# Altium project IM_v1.0.PrjPcb (part 1 of 2)
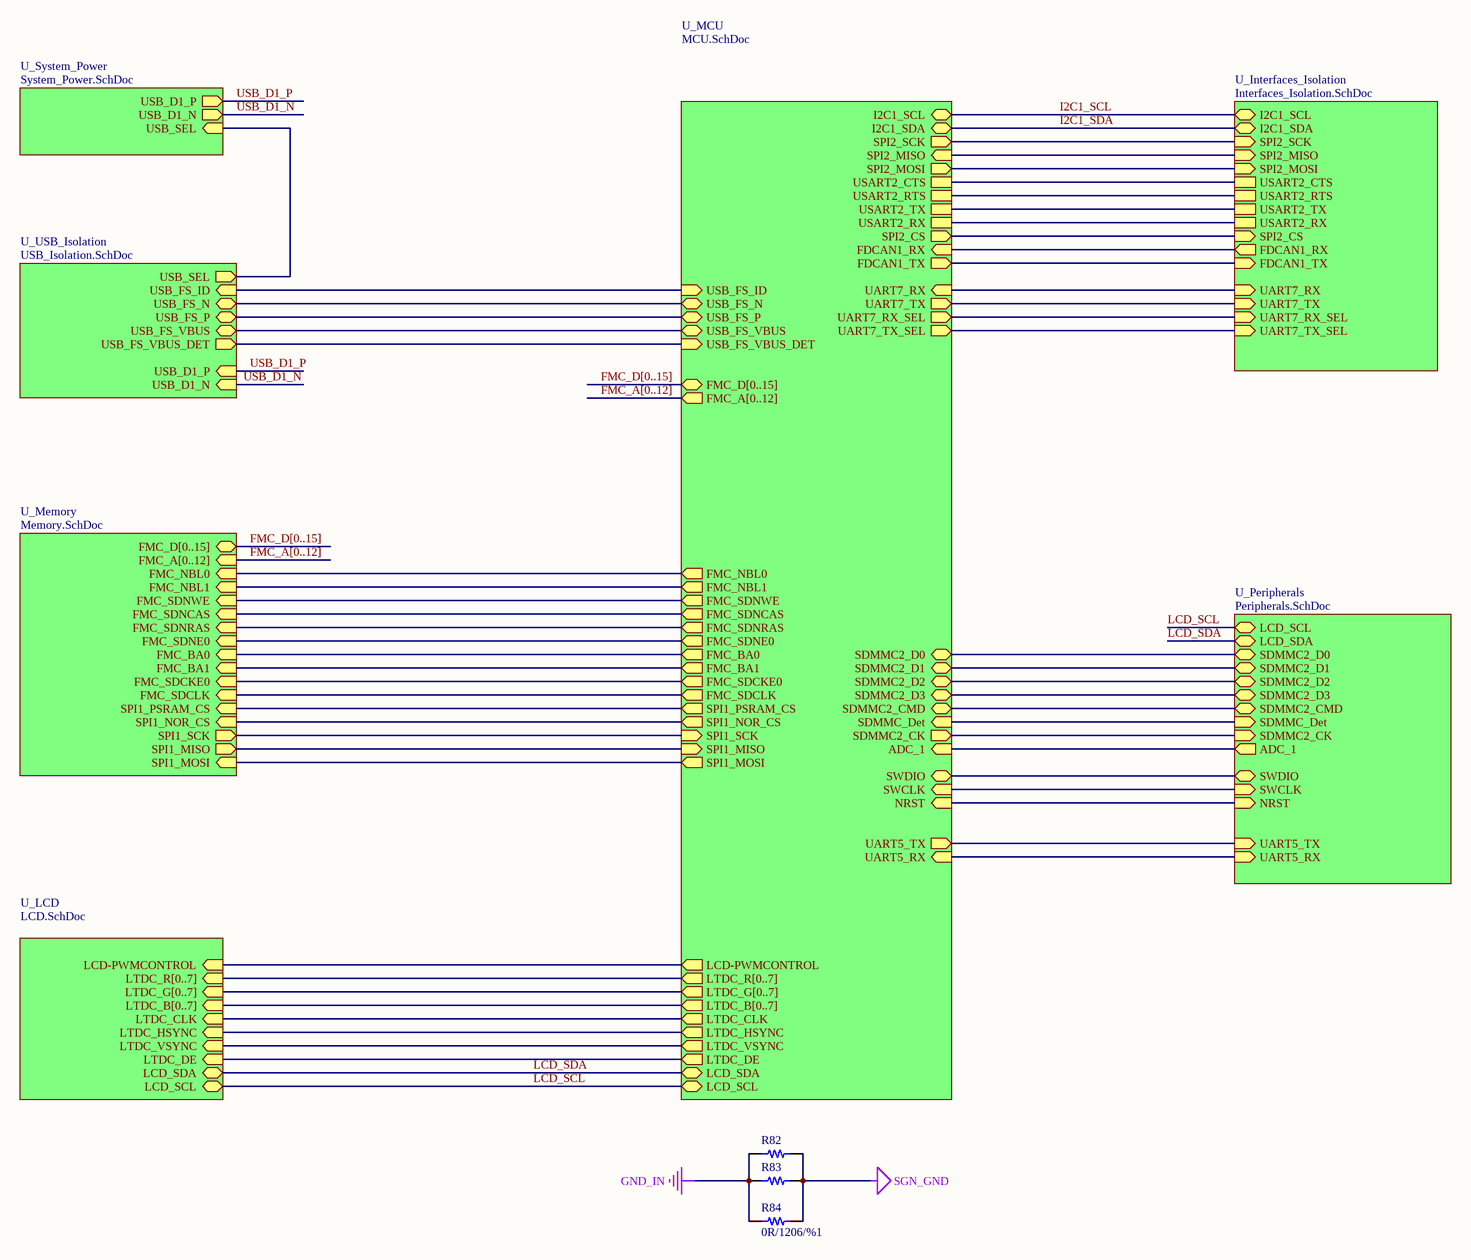
[diagram p0: Main.SchDoc]
8 sheets, 293 parts. Net scope: hierarchical (ports join the sheet entries above them; power ports are global).
Board files: IM_v1.0.PcbDoc, IM_v1.1.PcbDoc
Sheets:
  Main.SchDoc
    U_Interfaces_Isolation = Interfaces_Isolation.SchDoc
    U_LCD = LCD.SchDoc
    U_Memory = Memory.SchDoc
    U_Peripherals = Peripherals.SchDoc
    U_System_Power = System_Power.SchDoc
    U_USB_Isolation = USB_Isolation.SchDoc
    U_MCU = MCU.SchDoc

## Sheet Main.SchDoc
size A3; SheetNumber: 1; SheetTotal: 8

### Parts
R82  0R/1206/%1  [1206_res]  (value not drawn)
R83  0R/1206/%1  [1206_res]  (value not drawn)
R84  0R/1206/%1  [1206_res]

### Sub-sheets
U_Interfaces_Isolation = Interfaces_Isolation.SchDoc: I2C1_SCL (bidir), I2C1_SDA (bidir), SPI2_SCK (in), SPI2_MISO (in), SPI2_MOSI (in), USART2_CTS, USART2_RTS, USART2_TX, USART2_RX, FDCAN1_RX (out), FDCAN1_TX (in), SPI2_CS (in), UART7_RX (in), UART7_TX (in), UART7_RX_SEL (in), UART7_TX_SEL (in)
U_LCD = LCD.SchDoc: LTDC_R[0..7] (in), LTDC_G[0..7] (in), LTDC_B[0..7] (in), LTDC_CLK (in), LTDC_HSYNC (in), LTDC_VSYNC (in), LTDC_DE (in), LCD_SDA (bidir), LCD_SCL (bidir), LCD-PWMCONTROL (in)
U_MCU = MCU.SchDoc: LTDC_R[0..7] (out), LTDC_G[0..7] (out), LTDC_B[0..7] (out), FMC_D[0..15] (bidir), FMC_A[0..12] (out), FMC_NBL1 (out), FMC_SDNWE (out), FMC_SDNCAS (out), FMC_SDNRAS (out), FMC_SDNE0 (out), FMC_BA0 (out), FMC_BA1 (out), FMC_SDCKE0 (out), FMC_SDCLK (out), FMC_NBL0 (out), USART2_CTS, USART2_RTS, USART2_TX, USART2_RX, SPI1_MISO (in), SPI1_MOSI (out), SPI1_SCK (in), I2C1_SCL (bidir), I2C1_SDA (bidir), LCD_SDA (bidir), LCD_SCL (bidir), FDCAN1_RX (in), FDCAN1_TX (out), SPI2_MOSI (out), SPI2_SCK (out), SPI2_MISO (in), LCD-PWMCONTROL (out), LTDC_VSYNC (out), LTDC_HSYNC (out), LTDC_DE (out), LTDC_CLK (out), SPI1_NOR_CS (out), SPI2_CS (out), SPI1_PSRAM_CS (out), SDMMC2_D0 (bidir), SDMMC2_D1 (bidir), SDMMC2_D2 (bidir), SDMMC2_D3 (bidir), SDMMC2_CMD (bidir), SDMMC2_CK (out), SWDIO (bidir), SWCLK (in), NRST (in), UART5_RX (in), UART5_TX (out), SDMMC_Det (in), UART7_RX (in), UART7_TX (out), UART7_RX_SEL (out), UART7_TX_SEL (out), ADC_1 (in), USB_FS_ID (in), USB_FS_VBUS (bidir), USB_FS_N (bidir), USB_FS_P (bidir), USB_FS_VBUS_DET (in)
U_Memory = Memory.SchDoc: FMC_D[0..15] (bidir), FMC_A[0..12] (in), FMC_NBL1 (in), FMC_SDNWE (in), FMC_SDNCAS (in), FMC_SDNRAS (in), FMC_SDNE0 (in), FMC_BA0 (in), FMC_BA1 (in), FMC_SDCKE0 (in), FMC_SDCLK (in), FMC_NBL0 (in), SPI1_MISO (out), SPI1_MOSI (in), SPI1_SCK (out), SPI1_PSRAM_CS (in), SPI1_NOR_CS (in)
U_Peripherals = Peripherals.SchDoc: LCD_SCL (bidir), LCD_SDA (bidir), SDMMC2_D0 (bidir), SDMMC2_D1 (bidir), SDMMC2_D2 (bidir), SDMMC2_D3 (bidir), SDMMC2_CMD (bidir), SDMMC2_CK (in), SDMMC_Det (in), SWDIO (bidir), SWCLK (in), UART5_RX (in), UART5_TX (in), NRST (in), ADC_1 (out)
U_System_Power = System_Power.SchDoc: USB_D1_P (out), USB_D1_N (out), USB_SEL (in)
U_USB_Isolation = USB_Isolation.SchDoc: USB_D1_P (in), USB_D1_N (in), USB_SEL (out), USB_FS_ID (in), USB_FS_N (bidir), USB_FS_P (bidir), USB_FS_VBUS (bidir), USB_FS_VBUS_DET (out)

### Nets
GND_IN: R82.2 R83.2 R84.2
SGN_GND: R82.1 R83.1 R84.1
ADC_1: sheet U_Peripherals/ADC_1, sheet U_MCU/ADC_1
FDCAN1_RX: sheet U_Interfaces_Isolation/FDCAN1_RX, sheet U_MCU/FDCAN1_RX
FDCAN1_TX: sheet U_Interfaces_Isolation/FDCAN1_TX, sheet U_MCU/FDCAN1_TX
FMC_BA0: sheet U_Memory/FMC_BA0, sheet U_MCU/FMC_BA0
FMC_BA1: sheet U_Memory/FMC_BA1, sheet U_MCU/FMC_BA1
FMC_NBL0: sheet U_Memory/FMC_NBL0, sheet U_MCU/FMC_NBL0
FMC_NBL1: sheet U_Memory/FMC_NBL1, sheet U_MCU/FMC_NBL1
FMC_SDCKE0: sheet U_Memory/FMC_SDCKE0, sheet U_MCU/FMC_SDCKE0
FMC_SDCLK: sheet U_Memory/FMC_SDCLK, sheet U_MCU/FMC_SDCLK
FMC_SDNCAS: sheet U_Memory/FMC_SDNCAS, sheet U_MCU/FMC_SDNCAS
FMC_SDNE0: sheet U_Memory/FMC_SDNE0, sheet U_MCU/FMC_SDNE0
FMC_SDNRAS: sheet U_Memory/FMC_SDNRAS, sheet U_MCU/FMC_SDNRAS
FMC_SDNWE: sheet U_Memory/FMC_SDNWE, sheet U_MCU/FMC_SDNWE
I2C1_SCL: sheet U_Interfaces_Isolation/I2C1_SCL, sheet U_MCU/I2C1_SCL
I2C1_SDA: sheet U_Interfaces_Isolation/I2C1_SDA, sheet U_MCU/I2C1_SDA
LCD-PWMCONTROL: sheet U_LCD/LCD-PWMCONTROL, sheet U_MCU/LCD-PWMCONTROL
LCD_SCL: sheet U_LCD/LCD_SCL, sheet U_Peripherals/LCD_SCL, sheet U_MCU/LCD_SCL
LCD_SDA: sheet U_LCD/LCD_SDA, sheet U_Peripherals/LCD_SDA, sheet U_MCU/LCD_SDA
LTDC_CLK: sheet U_LCD/LTDC_CLK, sheet U_MCU/LTDC_CLK
LTDC_DE: sheet U_LCD/LTDC_DE, sheet U_MCU/LTDC_DE
LTDC_HSYNC: sheet U_LCD/LTDC_HSYNC, sheet U_MCU/LTDC_HSYNC
LTDC_VSYNC: sheet U_LCD/LTDC_VSYNC, sheet U_MCU/LTDC_VSYNC
NRST: sheet U_Peripherals/NRST, sheet U_MCU/NRST
SDMMC2_CK: sheet U_Peripherals/SDMMC2_CK, sheet U_MCU/SDMMC2_CK
SDMMC2_CMD: sheet U_Peripherals/SDMMC2_CMD, sheet U_MCU/SDMMC2_CMD
SDMMC2_D0: sheet U_Peripherals/SDMMC2_D0, sheet U_MCU/SDMMC2_D0
SDMMC2_D1: sheet U_Peripherals/SDMMC2_D1, sheet U_MCU/SDMMC2_D1
SDMMC2_D2: sheet U_Peripherals/SDMMC2_D2, sheet U_MCU/SDMMC2_D2
SDMMC2_D3: sheet U_Peripherals/SDMMC2_D3, sheet U_MCU/SDMMC2_D3
SDMMC_Det: sheet U_Peripherals/SDMMC_Det, sheet U_MCU/SDMMC_Det
SPI1_MISO: sheet U_Memory/SPI1_MISO, sheet U_MCU/SPI1_MISO
SPI1_MOSI: sheet U_Memory/SPI1_MOSI, sheet U_MCU/SPI1_MOSI
SPI1_NOR_CS: sheet U_Memory/SPI1_NOR_CS, sheet U_MCU/SPI1_NOR_CS
SPI1_PSRAM_CS: sheet U_Memory/SPI1_PSRAM_CS, sheet U_MCU/SPI1_PSRAM_CS
SPI1_SCK: sheet U_Memory/SPI1_SCK, sheet U_MCU/SPI1_SCK
SPI2_CS: sheet U_Interfaces_Isolation/SPI2_CS, sheet U_MCU/SPI2_CS
SPI2_MISO: sheet U_Interfaces_Isolation/SPI2_MISO, sheet U_MCU/SPI2_MISO
SPI2_MOSI: sheet U_Interfaces_Isolation/SPI2_MOSI, sheet U_MCU/SPI2_MOSI
SPI2_SCK: sheet U_Interfaces_Isolation/SPI2_SCK, sheet U_MCU/SPI2_SCK
SWCLK: sheet U_Peripherals/SWCLK, sheet U_MCU/SWCLK
SWDIO: sheet U_Peripherals/SWDIO, sheet U_MCU/SWDIO
UART5_RX: sheet U_Peripherals/UART5_RX, sheet U_MCU/UART5_RX
UART5_TX: sheet U_Peripherals/UART5_TX, sheet U_MCU/UART5_TX
UART7_RX: sheet U_Interfaces_Isolation/UART7_RX, sheet U_MCU/UART7_RX
UART7_RX_SEL: sheet U_Interfaces_Isolation/UART7_RX_SEL, sheet U_MCU/UART7_RX_SEL
UART7_TX: sheet U_Interfaces_Isolation/UART7_TX, sheet U_MCU/UART7_TX
UART7_TX_SEL: sheet U_Interfaces_Isolation/UART7_TX_SEL, sheet U_MCU/UART7_TX_SEL
USART2_CTS: sheet U_Interfaces_Isolation/USART2_CTS, sheet U_MCU/USART2_CTS
USART2_RTS: sheet U_Interfaces_Isolation/USART2_RTS, sheet U_MCU/USART2_RTS
USART2_RX: sheet U_Interfaces_Isolation/USART2_RX, sheet U_MCU/USART2_RX
USART2_TX: sheet U_Interfaces_Isolation/USART2_TX, sheet U_MCU/USART2_TX
USB_D1_N: sheet U_System_Power/USB_D1_N, sheet U_USB_Isolation/USB_D1_N
USB_D1_P: sheet U_System_Power/USB_D1_P, sheet U_USB_Isolation/USB_D1_P
USB_FS_ID: sheet U_USB_Isolation/USB_FS_ID, sheet U_MCU/USB_FS_ID
USB_FS_N: sheet U_USB_Isolation/USB_FS_N, sheet U_MCU/USB_FS_N
USB_FS_P: sheet U_USB_Isolation/USB_FS_P, sheet U_MCU/USB_FS_P
USB_FS_VBUS: sheet U_USB_Isolation/USB_FS_VBUS, sheet U_MCU/USB_FS_VBUS
USB_FS_VBUS_DET: sheet U_USB_Isolation/USB_FS_VBUS_DET, sheet U_MCU/USB_FS_VBUS_DET
USB_SEL: sheet U_System_Power/USB_SEL, sheet U_USB_Isolation/USB_SEL

### Buses and harness runs
bus FMC_A[0..12] = sheet U_MCU/FMC_A[0..12]
bus FMC_A[0..12] = sheet U_Memory/FMC_A[0..12]
bus FMC_D[0..15] = sheet U_MCU/FMC_D[0..15]
bus FMC_D[0..15] = sheet U_Memory/FMC_D[0..15]
bus sheet U_LCD/LTDC_B[0..7] = sheet U_MCU/LTDC_B[0..7]
bus sheet U_LCD/LTDC_G[0..7] = sheet U_MCU/LTDC_G[0..7]
bus sheet U_LCD/LTDC_R[0..7] = sheet U_MCU/LTDC_R[0..7]

### Library data of the parts
R82-R84 = RES: Assembly: .; HelpURL: *; PN: *; Value: 0R/1206/%1

## Sheet Interfaces_Isolation.SchDoc
size 508 x 292 mm; SheetNumber: 3; SheetTotal: 8
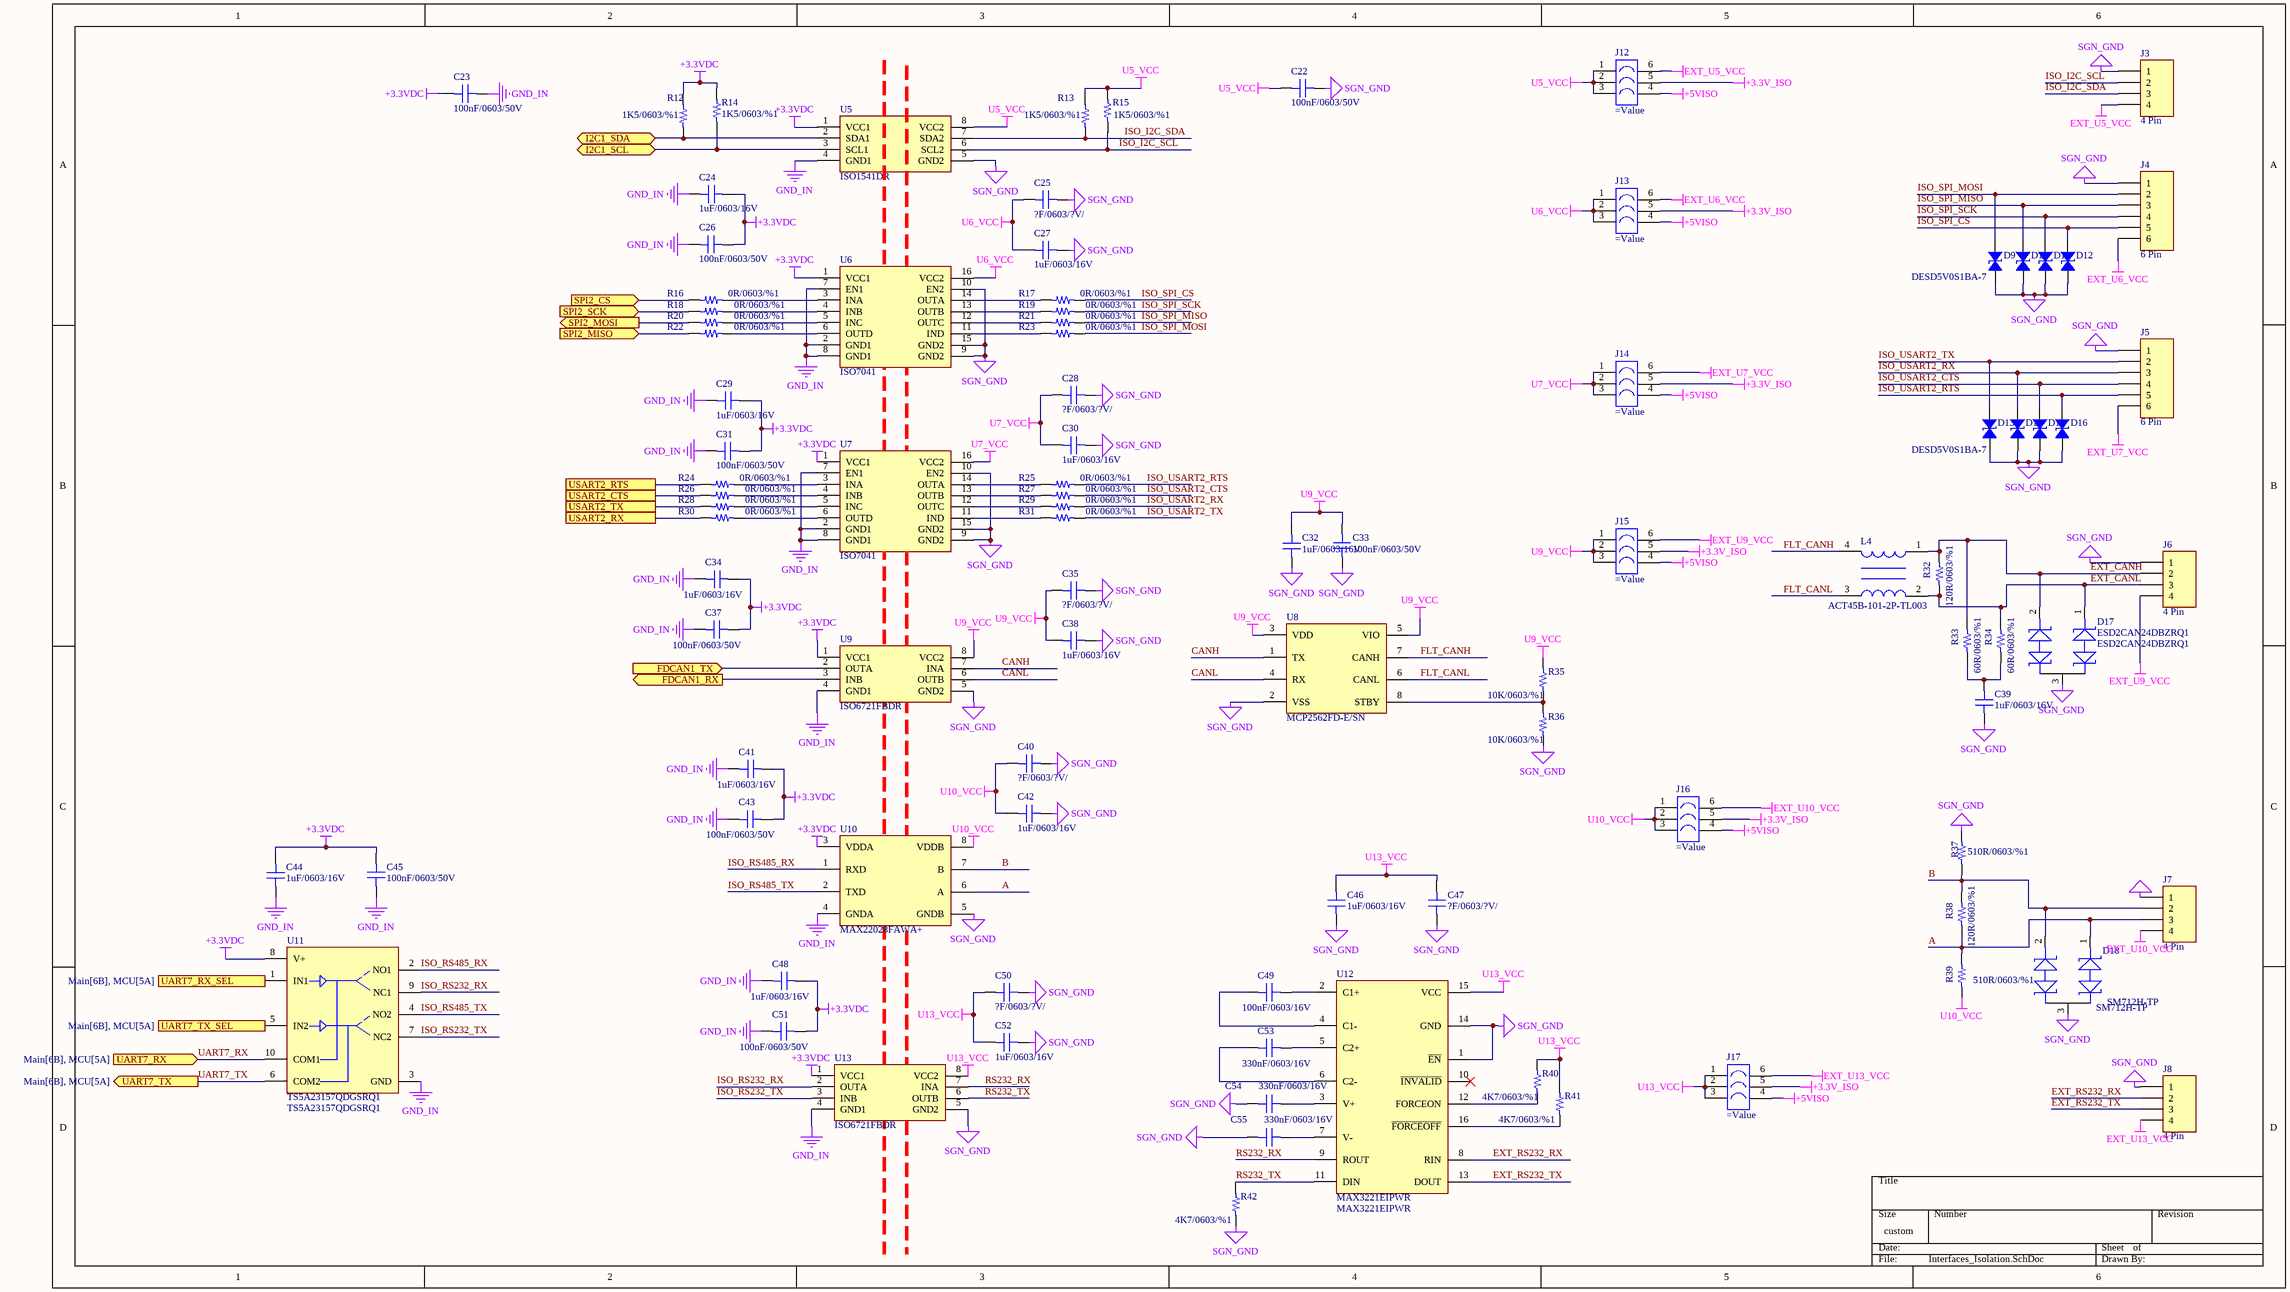
[diagram p1: Interfaces_Isolation.SchDoc]

### Parts
C22  100nF/0603/50V  [0603_cap]
C23  100nF/0603/50V  [0603_cap]
C24  1uF/0603/16V  [0603_cap]
C25  ?F/0603/?V/  [0603_cap]
C26  100nF/0603/50V  [0603_cap]
C27  1uF/0603/16V  [0603_cap]
C28  ?F/0603/?V/  [0603_cap]
C29  1uF/0603/16V  [0603_cap]
C30  1uF/0603/16V  [0603_cap]
C31  100nF/0603/50V  [0603_cap]
C32  1uF/0603/16V  [0603_cap]
C33  100nF/0603/50V  [0603_cap]
C34  1uF/0603/16V  [0603_cap]
C35  ?F/0603/?V/  [0603_cap]
C37  100nF/0603/50V  [0603_cap]
C38  1uF/0603/16V  [0603_cap]
C39  1uF/0603/16V  [0603_cap]
C40  ?F/0603/?V/  [0603_cap]
C41  1uF/0603/16V  [0603_cap]
C42  1uF/0603/16V  [0603_cap]
C43  100nF/0603/50V  [0603_cap]
C44  1uF/0603/16V  [0603_cap]
C45  100nF/0603/50V  [0603_cap]
C46  1uF/0603/16V  [0603_cap]
C47  ?F/0603/?V/  [0603_cap]
C48  1uF/0603/16V  [0603_cap]
C49  100nF/0603/16V  [0603_cap]
C50  ?F/0603/?V/  [0603_cap]
C51  100nF/0603/50V  [0603_cap]
C52  1uF/0603/16V  [0603_cap]
C53  330nF/0603/16V  [0603_cap]
C54  330nF/0603/16V  [0603_cap]
C55  330nF/0603/16V  [0603_cap]
D9  DESD5V0S1BA-7  [SOD323]
D10  DESD5V0S1BA-7  [SOD323]  (value not drawn)
D11  DESD5V0S1BA-7  [SOD323]  (value not drawn)
D12  DESD5V0S1BA-7  [SOD323]  (value not drawn)
D13  DESD5V0S1BA-7  [SOD323]
D14  DESD5V0S1BA-7  [SOD323]  (value not drawn)
D15  DESD5V0S1BA-7  [SOD323]  (value not drawn)
D16  DESD5V0S1BA-7  [SOD323]  (value not drawn)
D17  ESD2CAN24DBZRQ1  [TI SOT-23-3 DBZ]
D18  SM712H-TP  [TI SOT-23-3 DBZ]
J3  4 Pin  [R/A HEADER (4PİN)]
J4  6 Pin  [R/A HEADER]
J5  6 Pin  [R/A HEADER]
J6  4 Pin  [R/A HEADER (4PİN)]
J7  4 Pin  [R/A HEADER (4PİN)]
J8  4 Pin  [R/A HEADER (4PİN)]
J12  (no value)  [th_ra_6pins_1.27mm]
J13  (no value)  [th_ra_6pins_1.27mm]
J14  (no value)  [th_ra_6pins_1.27mm]
J15  (no value)  [th_ra_6pins_1.27mm]
J16  (no value)  [th_ra_6pins_1.27mm]
J17  (no value)  [th_ra_6pins_1.27mm]
L4  ACT45B-101-2P-TL003  [CMC((4.50mm x 3.20mm))]
R12  1K5/0603/%1  [0603_res]
R13  1K5/0603/%1  [0603_res]
R14  1K5/0603/%1  [0603_res]
R15  1K5/0603/%1  [0603_res]
R16  0R/0603/%1  [0603_res]
R17  0R/0603/%1  [0603_res]
R18  0R/0603/%1  [0603_res]
R19  0R/0603/%1  [0603_res]
R20  0R/0603/%1  [0603_res]
R21  0R/0603/%1  [0603_res]
R22  0R/0603/%1  [0603_res]
R23  0R/0603/%1  [0603_res]
R24  0R/0603/%1  [0603_res]
R25  0R/0603/%1  [0603_res]
R26  0R/0603/%1  [0603_res]
R27  0R/0603/%1  [0603_res]
R28  0R/0603/%1  [0603_res]
R29  0R/0603/%1  [0603_res]
R30  0R/0603/%1  [0603_res]
R31  0R/0603/%1  [0603_res]
R32  120R/0603/%1  [0603_res]
R33  60R/0603/%1  [0603_res]
R34  60R/0603/%1  [0603_res]
R35  10K/0603/%1  [0603_res]
R36  10K/0603/%1  [0603_res]
R37  510R/0603/%1  [0603_res]
R38  120R/0603/%1  [0603_res]
R39  510R/0603/%1  [0603_res]
R40  4K7/0603/%1  [0603_res]
R41  4K7/0603/%1  [0603_res]
R42  4K7/0603/%1  [0603_res]
U5  ISO1541DR  [SOIC-8(3.90MM)]
U6  ISO7041  [16-SSOP (0.154", 3.90mm Width)]
U7  ISO7041  [16-SSOP (0.154", 3.90mm Width)]
U8  MCP2562FD-E/SN  [SOIC-8(3.90MM)]
U9  ISO6721FBDR  [SOIC-8(3.90MM)]
U10  MAX22028FAWA+  [8-SOIC (0.209", 5.30mm Width)]
U11  TS5A23157QDGSRQ1  [VSSOP-10]
U12  MAX3221EIPWR  [16-TSSOP]
U13  ISO6721FBDR  [SOIC-8(3.90MM)]

### Ports
FDCAN1_RX (out, see Main[6B], MCU[3A]), FDCAN1_TX (in, see Main[6B], MCU[3A]), I2C1_SCL (bidir, see Main[6A], MCU[6A]), I2C1_SDA (bidir, see Main[6A], MCU[6A]), SPI2_CS (in, see Main[6B], MCU[6A]), SPI2_MISO (in, see Main[6A], MCU[6A]), SPI2_MOSI (out, see Main[6A], MCU[6A]), SPI2_SCK (in, see Main[6A], MCU[6A]), UART7_RX (in, see Main[6B], MCU[5A]), UART7_RX_SEL (in, see Main[6B], MCU[5A]), UART7_TX (out, see Main[6B], MCU[5A]), UART7_TX_SEL (in, see Main[6B], MCU[5A]), USART2_CTS (see Main[6A], MCU[4A]), USART2_RTS (see Main[6B], MCU[4A]), USART2_RX (see Main[6B], MCU[4A]), USART2_TX (see Main[6B], MCU[4A])

### Nets
+3.3V_ISO: J12.5 J13.5 J14.5 J15.5 J16.5 J17.5
+3.3VDC: C23.2 C24.2 C26.1 C29.2 C31.1 C34.2 C37.1 C41.2 C43.1 C44.2 C45.1 C48.2 C51.1 R12.2 R14.1 U5.1(VCC1) U6.1(VCC1) U7.1(VCC1) U9.1(VCC1) U10.3(VDDA) U11.8(V+) U13.1(VCC1)
+5VISO: J12.4 J13.4 J14.4 J15.4 J16.4 J17.4
EXT_U5_VCC: J3.4 J12.6
EXT_U6_VCC: J4.6 J13.6
EXT_U7_VCC: J5.6 J14.6
EXT_U9_VCC: J6.4 J15.6
EXT_U10_VCC: J7.4 J16.6
EXT_U13_VCC: J8.4 J17.6
GND_IN: C23.1 C24.1 C26.2 C29.1 C31.2 C34.1 C37.2 C41.1 C43.2 C44.1 C45.2 C48.1 C51.2 U5.4(GND1) U6.2(GND1) U6.7(EN1) U6.8(GND1) U7.2(GND1) U7.7(EN1) U7.8(GND1) U9.4(GND1) U10.4(GNDA) U11.3(GND) U13.4(GND1)
SGN_GND: C22.1 C25.1 C27.1 C28.1 C30.1 C32.1 C33.2 C35.1 C38.1 C39.1 C40.1 C42.1 C46.1 C47.1 C50.1 C52.1 C54.2 C55.2 D9.1 D10.1 D11.1 D12.1 D13.1 D14.1 D15.1 D16.1 D17.3 D18.3 J3.1 J4.1 J5.1 J6.1 J7.1 J8.1 R36.2 R37.1 R42.2 U5.5(GND2) U6.9(GND2) U6.10(EN2) U6.15(GND2) U7.9(GND2) U7.10(EN2) U7.15(GND2) U8.2(VSS) U9.5(GND2) U10.5(GNDB) U12.1(~{EN}) U12.14(GND) U13.5(GND2)
U5_VCC: C22.2 J12.1 J12.2 J12.3 R13.2 R15.1 U5.8(VCC2)
U6_VCC: C25.2 C27.2 J13.1 J13.2 J13.3 U6.16(VCC2)
U7_VCC: C28.2 C30.2 J14.1 J14.2 J14.3 U7.16(VCC2)
U9_VCC: C32.2 C33.1 C35.2 C38.2 J15.1 J15.2 J15.3 R35.1 U8.3(VDD) U8.5(VIO) U9.8(VCC2)
U10_VCC: C40.2 C42.2 J16.1 J16.2 J16.3 R39.2 U10.8(VDDB)
U13_VCC: C46.2 C47.2 C50.2 C52.2 J17.1 J17.2 J17.3 R40.1 R41.1 U12.15(VCC) U13.8(VCC2)
A: D18.1 J7.3 R38.2 R39.1 U10.6(A)
B: D18.2 J7.2 R37.2 R38.1 U10.7(B)
CANH: U8.1(TX) U9.7(INA)
CANL: U8.4(RX) U9.6(OUTB)
EXT_CANH: D17.2 J6.2 L4.1 R32.1 R33.1
EXT_CANL: D17.1 J6.3 L4.2 R32.2 R34.1
EXT_RS232_RX: J8.2 U12.8(RIN)
EXT_RS232_TX: J8.3 U12.13(DOUT)
FDCAN1_RX: U9.3(INB) ; port FDCAN1_RX
FDCAN1_TX: U9.2(OUTA) ; port FDCAN1_TX
FLT_CANH: L4.4 U8.7(CANH)
FLT_CANL: L4.3 U8.6(CANL)
I2C1_SCL: R14.2 U5.3(SCL1) ; port I2C1_SCL
I2C1_SDA: R12.1 U5.2(SDA1) ; port I2C1_SDA
ISO_I2C_SCL: J3.2 R15.2 U5.6(SCL2)
ISO_I2C_SDA: J3.3 R13.1 U5.7(SDA2)
ISO_RS232_RX: U11.9(NC1) U13.2(OUTA)
ISO_RS232_TX: U11.7(NC2) U13.3(INB)
ISO_RS485_RX: U10.1(RXD) U11.2(NO1)
ISO_RS485_TX: U10.2(TXD) U11.4(NO2)
ISO_SPI_CS: D12.2 J4.5 R17.1
ISO_SPI_MISO: D10.2 J4.3 R21.1
ISO_SPI_MOSI: D9.2 J4.2 R23.1
ISO_SPI_SCK: D11.2 J4.4 R19.1
ISO_USART2_CTS: D15.2 J5.4 R27.1
ISO_USART2_RTS: D16.2 J5.5 R25.1
ISO_USART2_RX: D14.2 J5.3 R29.1
ISO_USART2_TX: D13.2 J5.2 R31.1
RS232_RX: U12.9(ROUT) U13.7(INA)
RS232_TX: R42.1 U12.11(DIN) U13.6(OUTB)
SPI2_CS: R16.2 ; port SPI2_CS
SPI2_MISO: R22.2 ; port SPI2_MISO
SPI2_MOSI: R20.2 ; port SPI2_MOSI
SPI2_SCK: R18.2 ; port SPI2_SCK
UART7_RX: U11.10(COM1) ; port UART7_RX
UART7_RX_SEL: U11.1(IN1) ; port UART7_RX_SEL
UART7_TX: U11.6(COM2) ; port UART7_TX
UART7_TX_SEL: U11.5(IN2) ; port UART7_TX_SEL
USART2_CTS: R26.2 ; port USART2_CTS
USART2_RTS: R24.2 ; port USART2_RTS
USART2_RX: R30.2 ; port USART2_RX
USART2_TX: R28.2 ; port USART2_TX
NetC39_2: C39.2 R33.2 R34.2
NetC49_1: C49.1 U12.2(C1+)
NetC49_2: C49.2 U12.4(C1-)
NetC53_1: C53.1 U12.5(C2+)
NetC53_2: C53.2 U12.6(C2-)
NetC54_1: C54.1 U12.3(V+)
NetC55_1: C55.1 U12.7(V-)
NetR16_1: R16.1 U6.3(INA)
NetR17_2: R17.2 U6.14(OUTA)
NetR18_1: R18.1 U6.4(INB)
NetR19_2: R19.2 U6.13(OUTB)
NetR20_1: R20.1 U6.5(INC)
NetR21_2: R21.2 U6.12(OUTC)
NetR22_1: R22.1 U6.6(OUTD)
NetR23_2: R23.2 U6.11(IND)
NetR24_1: R24.1 U7.3(INA)
NetR25_2: R25.2 U7.14(OUTA)
NetR26_1: R26.1 U7.4(INB)
NetR27_2: R27.2 U7.13(OUTB)
NetR28_1: R28.1 U7.5(INC)
NetR29_2: R29.2 U7.12(OUTC)
NetR30_1: R30.1 U7.6(OUTD)
NetR31_2: R31.2 U7.11(IND)
NetR35_2: R35.2 R36.1 U8.8(STBY)
NetR40_2: R40.2 U12.12(FORCEON)
NetR41_2: R41.2 U12.16(~{FORCEOFF})

Not connected (* = marked no-connect by the designer): U12 10(~{INVALID})*

### Library data of the parts
C22-C35 C37-C55 = Capacitor: HelpURL: *; PN: *; Assembly: *
  C22 C23 C26 C31 C33 C37 C43 C45 C51: Value: 100nF/0603/50V
  C24 C27 C29 C30 C32 C34 C38 C39 C41 C42 C44 C46 C48 C52: Value: 1uF/0603/16V
  C25 C28 C35 C40 C47 C50: Value: ?F/0603/?V/
  C49: Value: 100nF/0603/16V
  C53-C55: Value: 330nF/0603/16V
D9-D16 = TVS BI: Zener Diode; Assembly: .; HelpURL: https://www.digikey.com/en/products/detail/diodes-incorporated/DESD5V0S1BA-7/3451477?s=N4IgTCBcDaICIFEDKcCsA1ADEgjAIQEEBaAdhAF0BfIA; PN: DESD5V0S1BA-7; Value: DESD5V0S1BA-7
D17 = SM712H-TP: 37V (Typ) Clamp 5.7A (8/20µs) Ipp Tvs Diode Surface Mount SOT-23-3; Assembly: .; HelpURL: https://www.digikey.com/en/products/detail/texas-instruments/ESD2CAN24DBZRQ1/16982061; PN: ESD2CAN24DBZRQ1; Value: ESD2CAN24DBZRQ1
D18 = SM712H-TP: TVS DIODE 12VWM 28VC SOT23; Assembly: .; HelpURL: https://www.digikey.com/en/products/detail/mcc-micro-commercial-components/SM712H-TP/12177158; PN: SM712H-TP; Value: SM712H-TP
J3 J6-J8 = 4 Pin: Value: 2EDGRC-5.08-04P; Assembly: .; PN: 2EDGRC-5.08-04P; HelpURL: https://www.ozdisan.com/p/gecmeli-klemensler-411/degson-2edgrc-5-08-04p-14-00ah-445450
J4 J5 = 6 Pin: Assembly: .; PN: 2EDGRC-5.08-04P-14-00AH; Value: 2EDGRC-5.08-04P-14-00AH; HelpURL: https://www.ozdisan.com/p/gecmeli-klemensler-411/degson-2edgrc-5-08-04p-14-00ah-445450
J12-J17 = 2x3_header
L4 = cmc: 100 µH @ 100 kHz 2 Line Common Mode Choke Surface Mount 5.8 kOhms @ 10 MHz 150mA DCR 2Ohm; Assembly: .; Help URL: https://www.digikey.com/en/products/detail/tdk-corporation/ACT45B-101-2P-TL003/1950643?s=N4IgTCBcDaIIIGEAqAWArAIQLQEYAMOWYAClkgDJ54DMIAugL5A; PN: ACT45B-101-2P-TL003; Value: ACT45B-101-2P-TL003
R12-R42 = RES: Assembly: .; HelpURL: *; PN: *
  R12-R15: Value: 1K5/0603/%1
  R16-R31: Value: 0R/0603/%1
  R32 R38: Value: 120R/0603/%1
  R33 R34: Value: 60R/0603/%1
  R35 R36: Value: 10K/0603/%1
  R37 R39: Value: 510R/0603/%1
  R40-R42: Value: 4K7/0603/%1
U5 = TI ISO154x: I2C Digital Isolator 2500Vrms 2 Channel 1Mbps 25kV/µs CMTI 8-SOIC (0.154", 3.90mm Width); Assembly: .; PN: ISO1541DR; Value: ISO1541DR; HelpURL: https://www.digikey.com/en/products/detail/texas-instruments/ISO1541DR/3587223?s=N4IgTCBcDaIJIGUDyBGArAFhQEQEogF0BfIA
U6 U7 = ISO7041: SPI Digital Isolator 3000Vrms 4 Channel 2Mbps 50kV/µs CMTI 16-SSOP (0.154", 3.90mm Width); Value: ISO7041DBQR; Assembly: .; PN: ISO7041DBQR; HelpURL: https://www.digikey.com/en/products/detail/texas-instruments/ISO7041DBQR/10448338
U8 = MCP2562FD-E/SN: 1/1 Transceiver CANbus 8-SOIC; Assembly: .; HelpURL: https://www.digikey.com/en/products/detail/microchip-technology/MCP2562FD-E-SN/4842808; PN: MCP2562FD-E/SN; Value: MCP2562FD-E/SN
U9 = ISO6721FBDR: CAN, RS232, RS485, SPI Digital Isolator 3000Vrms 2 Channel 50Mbps 100kV/µs CMTI 8-SOIC (0.154", 3.90mm Width); Assembly: .; HelpURL: https://www.digikey.com/en/products/detail/texas-instruments/ISO6721FBDR/13627193?s=N4IgTCBcDaIJIGUDyA2A7GAjAMQEIBEAlEAXQF8g; PN: ISO6721FBDR; Value: ISO6721FBDR
U10 = MAX22028FAWA+: 1/1 Transceiver, Isolated Half RS422, RS485 8-SOIC; Assembly: .; PN: MAX22028FAWA+; HelpURL: https://www.digikey.com/en/products/detail/analog-devices-inc-maxim-integrated/MAX22028FAWA/15652899; Value: MAX22028FAWA+
U11 = TS5A23157QDGSRQ1: IC SWITCH SPDT X 2 15OHM 10VSSOP; Assembly: .; PN: TS5A23157QDGSRQ1; HelpURL: https://www.digikey.com/en/products/detail/texas-instruments/TS5A23157QDGSRQ1/3996775; Value: TS5A23157QDGSRQ1
U12 = MAX3221EIPWR: IC TRANSCEIVER FULL 1/1 16TSSOP; Assembly: .; PN: MAX3221EIPWR; HelpURL: https://www.digikey.com/en/products/detail/texas-instruments/MAX3221EIPWR/964660?s=N4IgTCBcDaILIEEAaBmMYCMBRAkgBQHUAlEAXQF8g; Value: MAX3221EIPWR
U13 = ISO6721FBDR: CAN, RS232, RS485, SPI Digital Isolator 3000Vrms 2 Channel 50Mbps 100kV/µs CMTI 8-SOIC (0.154", 3.90mm Width); Assembly: *; HelpURL: https://www.digikey.com/en/products/detail/texas-instruments/ISO6721FBDR/13627193?s=N4IgTCBcDaIJIGUDyA2A7GAjAMQEIBEAlEAXQF8g; PN: ISO6721FBDR; Value: ISO6721FBDR

## Sheet LCD.SchDoc
size A4; SheetNumber: 6; SheetTotal: 8
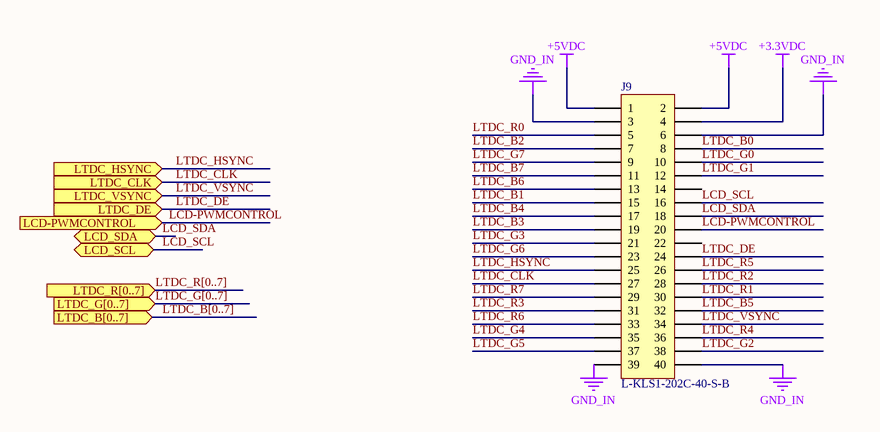
[diagram p2: LCD.SchDoc]

### Parts
J9  L-KLS1-202C-40-S-B  [L-KLS1-202C-40-T-B]

### Ports
LCD-PWMCONTROL (in, see Main[2D], MCU[1A]), LCD_SCL (bidir, see Main[2D], MCU[1A], Peripherals[1A]), LCD_SDA (bidir, see Main[2D], MCU[1A], Peripherals[1A]), LTDC_B[0..7] (in, see Main[2D], MCU[1A]), LTDC_CLK (in, see Main[2D], MCU[1A]), LTDC_DE (in, see Main[2D], MCU[1A]), LTDC_G[0..7] (in, see Main[2D], MCU[1A]), LTDC_HSYNC (in, see Main[2D], MCU[1A]), LTDC_R[0..7] (in, see Main[2D], MCU[1A]), LTDC_VSYNC (in, see Main[2D], MCU[1A])

### Nets
+3.3VDC: J9.4
+5VDC: J9.1 J9.2
GND_IN: J9.3 J9.6 J9.39 J9.40
LCD-PWMCONTROL: J9.20 ; port LCD-PWMCONTROL
LCD_SCL: J9.16 ; port LCD_SCL
LCD_SDA: J9.18 ; port LCD_SDA
LTDC_B0: J9.8
LTDC_B1: J9.15
LTDC_B2: J9.7
LTDC_B3: J9.19
LTDC_B4: J9.17
LTDC_B5: J9.32
LTDC_B6: J9.13
LTDC_B7: J9.11
LTDC_CLK: J9.27 ; port LTDC_CLK
LTDC_DE: J9.24 ; port LTDC_DE
LTDC_G0: J9.10
LTDC_G1: J9.12
LTDC_G2: J9.38
LTDC_G3: J9.21
LTDC_G4: J9.35
LTDC_G5: J9.37
LTDC_G6: J9.23
LTDC_G7: J9.9
LTDC_HSYNC: J9.25 ; port LTDC_HSYNC
LTDC_R0: J9.5
LTDC_R1: J9.30
LTDC_R2: J9.28
LTDC_R3: J9.31
LTDC_R4: J9.36
LTDC_R5: J9.26
LTDC_R6: J9.33
LTDC_R7: J9.29
LTDC_VSYNC: J9.34 ; port LTDC_VSYNC

Not connected (* = marked no-connect by the designer): J9 14 22

### Buses and harness runs
bus LTDC_B[0..7] = port LTDC_B[0..7]
bus LTDC_G[0..7] = port LTDC_G[0..7]
bus LTDC_R[0..7] = port LTDC_R[0..7]

### Library data of the parts
J9 = 2X20: BOX HEADER 40PIN(2x20) 1.27MM THT V/T MALE BLACK; Assembly: .; Value: L-KLS1-202C-40-S-B; PN: L-KLS1-202C-40-S-B; HelpURL: https://www.ozdisan.com/p/box-headerlar-295/kls-electronic-l-kls1-202c-40-s-b-531010

## Sheet Memory.SchDoc
size A4; SheetNumber: 5; SheetTotal: 8
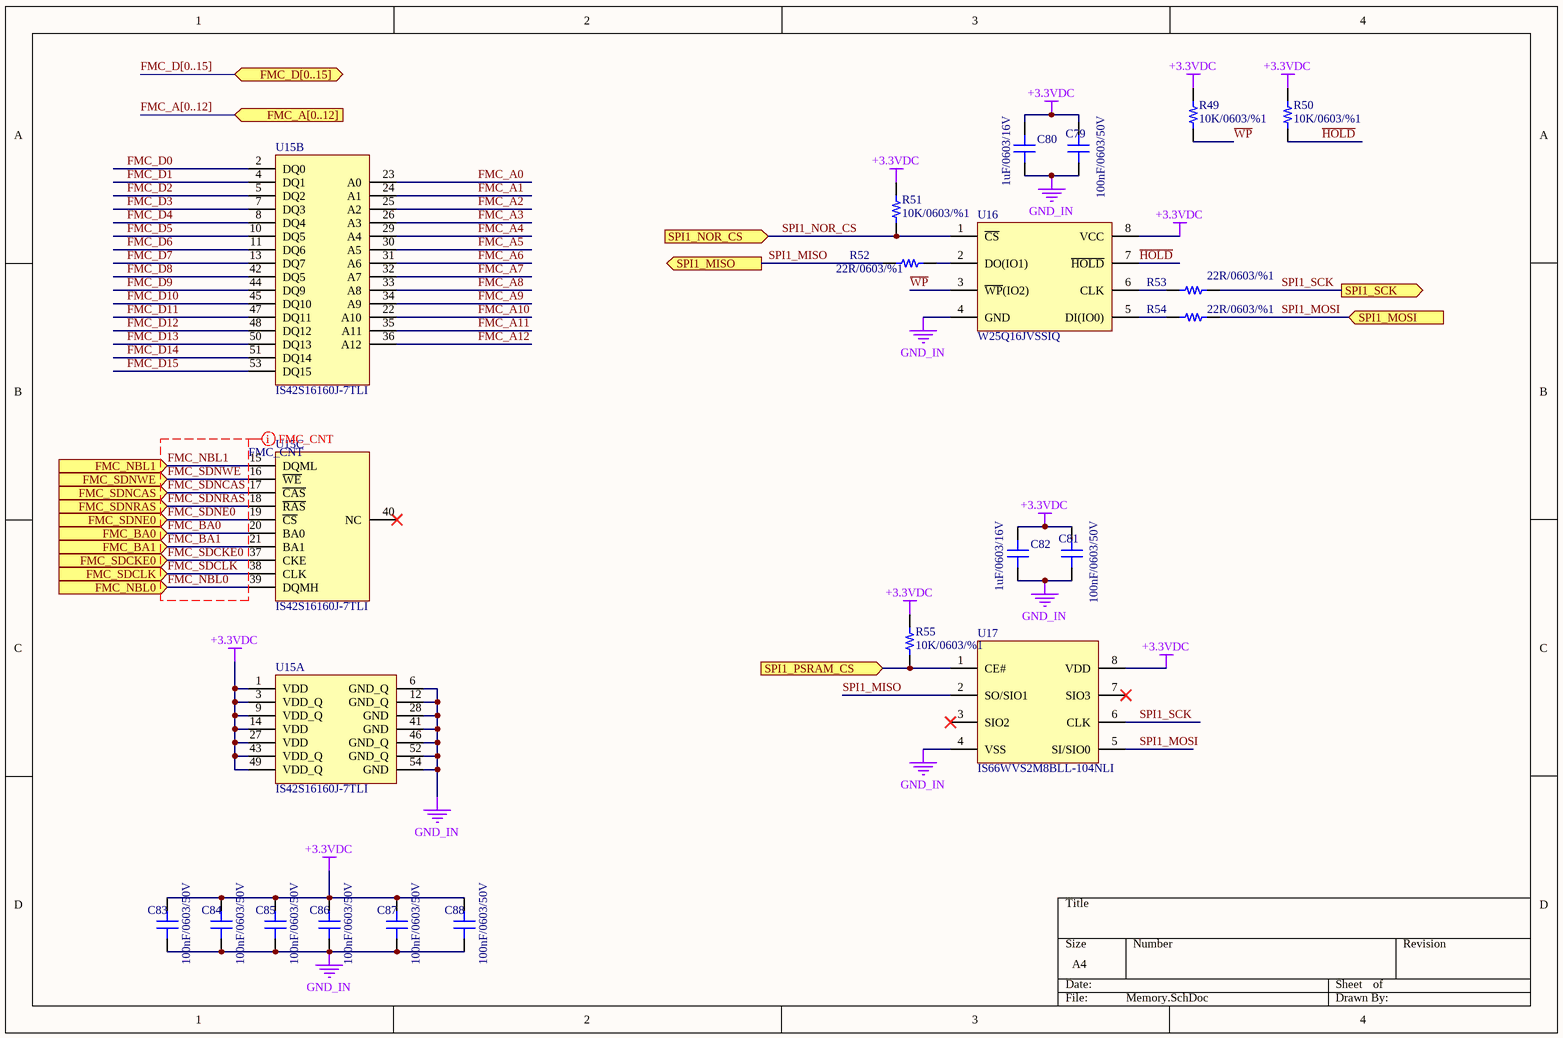
[diagram p3: Memory.SchDoc]

### Parts
C79  100nF/0603/50V  [0603_cap]
C80  1uF/0603/16V  [0603_cap]
C81  100nF/0603/50V  [0603_cap]
C82  1uF/0603/16V  [0603_cap]
C83  100nF/0603/50V  [0603_cap]
C84  100nF/0603/50V  [0603_cap]
C85  100nF/0603/50V  [0603_cap]
C86  100nF/0603/50V  [0603_cap]
C87  100nF/0603/50V  [0603_cap]
C88  100nF/0603/50V  [0603_cap]
R49  10K/0603/%1  [0603_res]
R50  10K/0603/%1  [0603_res]
R51  10K/0603/%1  [0603_res]
R52  22R/0603/%1  [0603_res]
R53  22R/0603/%1  [0603_res]
R54  22R/0603/%1  [0603_res]
R55  10K/0603/%1  [0603_res]
U15  IS42S16160J-7TLI  [TSOP-II-54]  (parts A,B,C of 3)
U16  W25Q16JVSSIQ  [8-SOIC (0.209", 5.30mm Width)]
U17  IS66WVS2M8BLL-104NLI  [SOIC-8(3.90MM)]

### Ports
FMC_A[0..12] (in, see Main[2B], MCU[2A]), FMC_BA0 (in, see Main[2C], MCU[2A]), FMC_BA1 (in, see Main[2C], MCU[2A]), FMC_D[0..15] (bidir, see Main[2B], MCU[2A]), FMC_NBL0 (in, see Main[2C], MCU[2A]), FMC_NBL1 (in, see Main[2C], MCU[2A]), FMC_SDCKE0 (in, see Main[2C], MCU[2A]), FMC_SDCLK (in, see Main[2C], MCU[2A]), FMC_SDNCAS (in, see Main[2C], MCU[2A]), FMC_SDNE0 (in, see Main[2C], MCU[2A]), FMC_SDNRAS (in, see Main[2C], MCU[2A]), FMC_SDNWE (in, see Main[2C], MCU[2A]), SPI1_MISO (out, see Main[2C], MCU[3A]), SPI1_MOSI (in, see Main[2C], MCU[3A]), SPI1_NOR_CS (in, see Main[2C], MCU[3A]), SPI1_PSRAM_CS (in, see Main[2C], MCU[3A]), SPI1_SCK (out, see Main[2C], MCU[3A])

### Nets
+3.3VDC: C79.1 C80.2 C81.1 C82.2 C83.1 C84.1 C85.1 C86.1 C87.1 C88.1 R49.1 R50.1 R51.1 R55.1 U15.1(VDD) U15.3(VDD_Q) U15.9(VDD_Q) U15.14(VDD) U15.27(VDD) U15.43(VDD_Q) U15.49(VDD_Q) U16.8(VCC) U17.8(VDD)
GND_IN: C79.2 C80.1 C81.2 C82.1 C83.2 C84.2 C85.2 C86.2 C87.2 C88.2 U15.6(GND_Q) U15.12(GND_Q) U15.28(GND) U15.41(GND) U15.46(GND_Q) U15.52(GND_Q) U15.54(GND) U16.4(GND) U17.4(VSS)
~{HOLD}: R50.2 U16.7(~{HOLD})
~{WP}: R49.2 U16.3(~{WP}(IO2))
FMC_A0: U15.23(A0)
FMC_A1: U15.24(A1)
FMC_A2: U15.25(A2)
FMC_A3: U15.26(A3)
FMC_A4: U15.29(A4)
FMC_A5: U15.30(A5)
FMC_A6: U15.31(A6)
FMC_A7: U15.32(A7)
FMC_A8: U15.33(A8)
FMC_A9: U15.34(A9)
FMC_A10: U15.22(A10)
FMC_A11: U15.35(A11)
FMC_A12: U15.36(A12)
FMC_BA0: U15.20(BA0) ; port FMC_BA0
FMC_BA1: U15.21(BA1) ; port FMC_BA1
FMC_D0: U15.2(DQ0)
FMC_D1: U15.4(DQ1)
FMC_D2: U15.5(DQ2)
FMC_D3: U15.7(DQ3)
FMC_D4: U15.8(DQ4)
FMC_D5: U15.10(DQ5)
FMC_D6: U15.11(DQ6)
FMC_D7: U15.13(DQ7)
FMC_D8: U15.42(DQ5)
FMC_D9: U15.44(DQ9)
FMC_D10: U15.45(DQ10)
FMC_D11: U15.47(DQ11)
FMC_D12: U15.48(DQ12)
FMC_D13: U15.50(DQ13)
FMC_D14: U15.51(DQ14)
FMC_D15: U15.53(DQ15)
FMC_NBL0: U15.39(DQMH) ; port FMC_NBL0
FMC_NBL1: U15.15(DQML) ; port FMC_NBL1
FMC_SDCKE0: U15.37(CKE) ; port FMC_SDCKE0
FMC_SDCLK: U15.38(CLK) ; port FMC_SDCLK
FMC_SDNCAS: U15.17(~{CAS}) ; port FMC_SDNCAS
FMC_SDNE0: U15.19(~{CS}) ; port FMC_SDNE0
FMC_SDNRAS: U15.18(~{RAS}) ; port FMC_SDNRAS
FMC_SDNWE: U15.16(~{WE}) ; port FMC_SDNWE
SPI1_MISO: R52.1 U17.2(SO/SIO1) ; port SPI1_MISO
SPI1_MOSI: R54.2 U17.5(SI/SIO0) ; port SPI1_MOSI
SPI1_NOR_CS: R51.2 U16.1(~{CS}) ; port SPI1_NOR_CS
SPI1_PSRAM_CS: R55.2 U17.1(CE#) ; port SPI1_PSRAM_CS
SPI1_SCK: R53.2 U17.6(CLK) ; port SPI1_SCK
NetR52_2: R52.2 U16.2(DO(IO1))
NetR53_1: R53.1 U16.6(CLK)
NetR54_1: R54.1 U16.5(DI(IO0))

Not connected (* = marked no-connect by the designer): U15 40(NC)*; U17 3(SIO2)* 7(SIO3)*

### Buses and harness runs
bus FMC_A[0..12] = port FMC_A[0..12]
bus FMC_D[0..15] = port FMC_D[0..15]

### Layout directives
net class FMC_CNT: FMC_BA0, FMC_BA1, FMC_NBL0, FMC_NBL1, FMC_SDCKE0, FMC_SDCLK, FMC_SDNCAS, FMC_SDNE0, FMC_SDNRAS, FMC_SDNWE

### Library data of the parts
C79-C88 = Capacitor: HelpURL: *; PN: *; Assembly: *
  C79 C81 C83-C88: Value: 100nF/0603/50V
  C80 C82: Value: 1uF/0603/16V
R49-R55 = RES: Assembly: .; HelpURL: *; PN: *
  R49-R51 R55: Value: 10K/0603/%1
  R52-R54: Value: 22R/0603/%1
U15 = IS42S16160J-7TLI: SDRAM Memory IC 256Mbit Parallel 143 MHz 5.4 ns 54-TSOP II; Assembly: .; Value: IS42S16160J-7TLI; PN: IS42S16160J-7TLI; HelpURL: https://www.digikey.com/en/products/detail/issi-integrated-silicon-solution-inc/IS42S16160J-7TLI/5319798
U16 = W25Q16JVSSIQ: FLASH - NOR Memory IC 16Mbit SPI - Quad I/O 133 MHz 8-SOIC; Assembly: .; Value: W25Q16JVSSIQ; PN: W25Q16JVSSIQ; HelpURL: https://www.digikey.com/en/products/detail/winbond-electronics/W25Q16JVSSIQ/6193769
U17 = IS66WVS2M8BLL-104NLI: PSRAM (Pseudo SRAM) Memory IC 16Mbit SPI, QPI 104 MHz 7 ns 8-SOIC; Assembly: .; Value: IS66WVS2M8BLL-104NLI; PN: IS66WVS2M8BLL-104NLI; HelpURL: https://www.digikey.com/en/products/detail/issi-integrated-silicon-solution-inc/IS66WVS2M8BLL-104NLI/16260610

## Sheet Peripherals.SchDoc
size A4; SheetNumber: 8; SheetTotal: 8
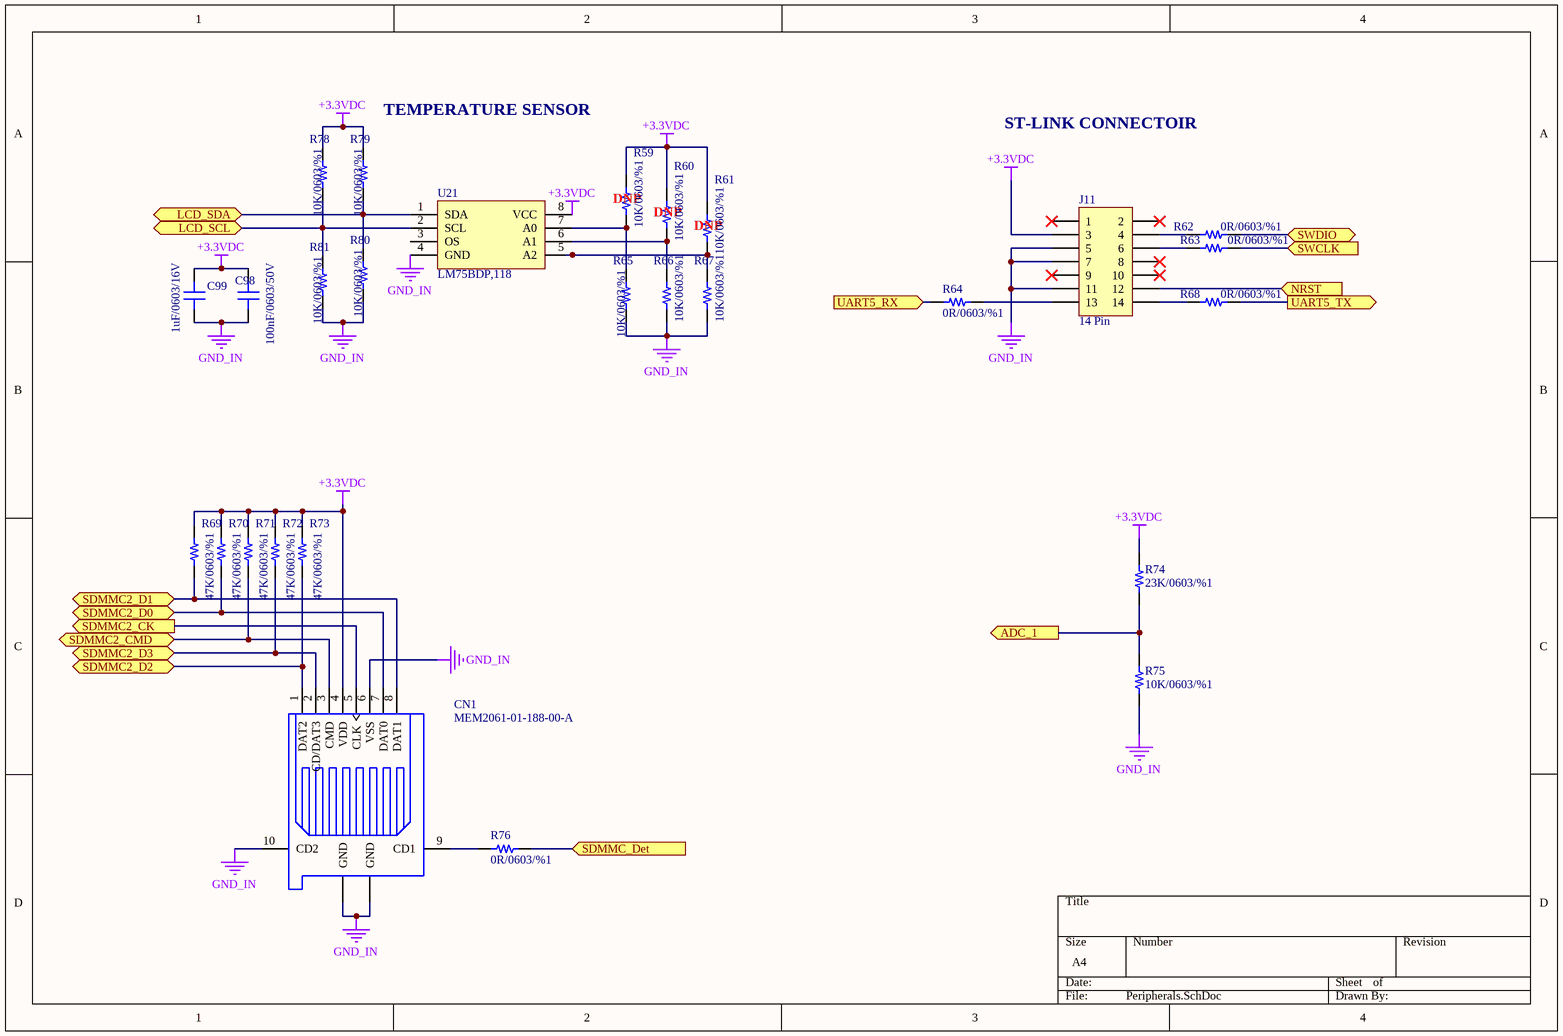
[diagram p4: Peripherals.SchDoc]

### Parts
C98  100nF/0603/50V  [0603_cap]
C99  1uF/0603/16V  [0603_cap]
CN1  MEM2061-01-188-00-A  [GCT_MEM2061-01-188-00-A_REVA]
J11  14 Pin  [L-KLS1-202C-14-S-B]
R59  10K/0603/%1  Assembly: DNP  [0603_res]
R60  10K/0603/%1  Assembly: DNP  [0603_res]
R61  10K/0603/%1  Assembly: DNP  [0603_res]
R62  0R/0603/%1  [0603_res]
R63  0R/0603/%1  [0603_res]
R64  0R/0603/%1  [0603_res]
R65  10K/0603/%1  [0603_res]
R66  10K/0603/%1  [0603_res]
R67  10K/0603/%1  [0603_res]
R68  0R/0603/%1  [0603_res]
R69  47K/0603/%1  [0603_res]
R70  47K/0603/%1  [0603_res]
R71  47K/0603/%1  [0603_res]
R72  47K/0603/%1  [0603_res]
R73  47K/0603/%1  [0603_res]
R74  23K/0603/%1  [0603_res]
R75  10K/0603/%1  [0603_res]
R76  0R/0603/%1  [0603_res]
R78  10K/0603/%1  [0603_res]
R79  10K/0603/%1  [0603_res]
R80  10K/0603/%1  [0603_res]
R81  10K/0603/%1  [0603_res]
U21  LM75BDP,118  [8-tssop]

### Ports
ADC_1 (out, see Main[6C], MCU[3B]), LCD_SCL (bidir, see Main[6C], LCD[1B], MCU[1A]), LCD_SDA (bidir, see Main[6C], LCD[1B], MCU[1A]), NRST (in, see Main[6C], MCU[7A]), SDMMC2_CK (out, see Main[6C], MCU[7A]), SDMMC2_CMD (bidir, see Main[6C], MCU[7A]), SDMMC2_D0 (bidir, see Main[6C], MCU[7A]), SDMMC2_D1 (bidir, see Main[6C], MCU[7A]), SDMMC2_D2 (bidir, see Main[6C], MCU[7A]), SDMMC2_D3 (bidir, see Main[6C], MCU[7A]), SDMMC_Det (in, see Main[6C], MCU[7A]), SWCLK (in, see Main[6C], MCU[7A]), SWDIO (bidir, see Main[6C], MCU[7A]), UART5_RX (in, see Main[6C], MCU[7A]), UART5_TX (out, see Main[6C], MCU[7A])

### Nets
+3.3VDC: C98.1 C99.2 CN1.4(VDD) J11.3 R59.1 R60.1 R61.1 R69.1 R70.1 R71.1 R72.1 R73.1 R74.1 R78.2 R79.2 U21.8(VCC)
GND_IN: C98.2 C99.1 CN1.6(VSS) CN1.10(CD2) CN1.11(GND) CN1.12(GND) J11.5 J11.7 J11.11 R65.1 R66.2 R67.2 R75.2 R80.1 R81.1 U21.4(GND)
ADC_1: R74.2 R75.1 ; port ADC_1
LCD_SCL: R78.1 R81.2 U21.2(SCL) ; port LCD_SCL
LCD_SDA: R79.1 R80.2 U21.1(SDA) ; port LCD_SDA
NRST: J11.12 ; port NRST
SDMMC2_CK: CN1.5(CLK) ; port SDMMC2_CK
SDMMC2_CMD: CN1.3(CMD) R71.2 ; port SDMMC2_CMD
SDMMC2_D0: CN1.7(DAT0) R70.2 ; port SDMMC2_D0
SDMMC2_D1: CN1.8(DAT1) R69.2 ; port SDMMC2_D1
SDMMC2_D2: CN1.1(DAT2) R73.2 ; port SDMMC2_D2
SDMMC2_D3: CN1.2(CD/DAT3) R72.2 ; port SDMMC2_D3
SDMMC_Det: R76.1 ; port SDMMC_Det
SWCLK: R63.1 ; port SWCLK
SWDIO: R62.1 ; port SWDIO
UART5_RX: R64.2 ; port UART5_RX
UART5_TX: R68.1 ; port UART5_TX
NetCN1_9: CN1.9(CD1) R76.2
NetJ11_4: J11.4 R62.2
NetJ11_6: J11.6 R63.2
NetJ11_13: J11.13 R64.1
NetJ11_14: J11.14 R68.2
NetR59_2: R59.2 R65.2 U21.7(A0)
NetR60_2: R60.2 R66.1 U21.6(A1)
NetR61_2: R61.2 R67.1 U21.5(A2)

Not connected (* = marked no-connect by the designer): J11 1* 2* 8* 9* 10*; U21 3(OS)

### Notes on the sheet
- (near R79) TEMPERATURE SENSOR
- ST-LINK CONNECTOIR

### Library data of the parts
C98 C99 = Capacitor: HelpURL: *; PN: *; Assembly: *
  C98: Value: 100nF/0603/50V
  C99: Value: 1uF/0603/16V
CN1 = MEM2061-01-188-00-A: 10 (8 + 2) Position Card Connector Secure Digital - microSD™ Surface Mount, Right Angle Gold; Assembly: .; Value: MEM2061-01-188-00-A; PN: MEM2061-01-188-00-A; HelpURL: https://www.digikey.com/en/products/detail/gct/MEM2061-01-188-00-A/9859612?s=N4IgTCBcDaILIFE5gAwDYCMBaF2MA58cUsBBEAXQF8g
R59-R61 = RES: HelpURL: *; PN: *; Value: 10K/0603/%1
R62-R76 R78-R81 = RES: Assembly: .; HelpURL: *; PN: *
  R62-R64 R68 R76: Value: 0R/0603/%1
  R65-R67 R75 R78-R81: Value: 10K/0603/%1
  R69-R73: Value: 47K/0603/%1
  R74: Value: 23K/0603/%1
U21 = LM75BDP,118: SENSOR DIGITAL -55C-125C 8TSSOP; Assembly: .; HelpURL: https://www.digikey.com/en/products/detail/nxp-usa-inc/LM75BDP-118/2075977; PN: LM75BDP,118; Value: LM75BDP,118
J11 = 14 Pin: Value: *; PN: *; HelpURL: *; Assembly: *

## Sheet System_Power.SchDoc
size A3; SheetNumber: 2; SheetTotal: 8
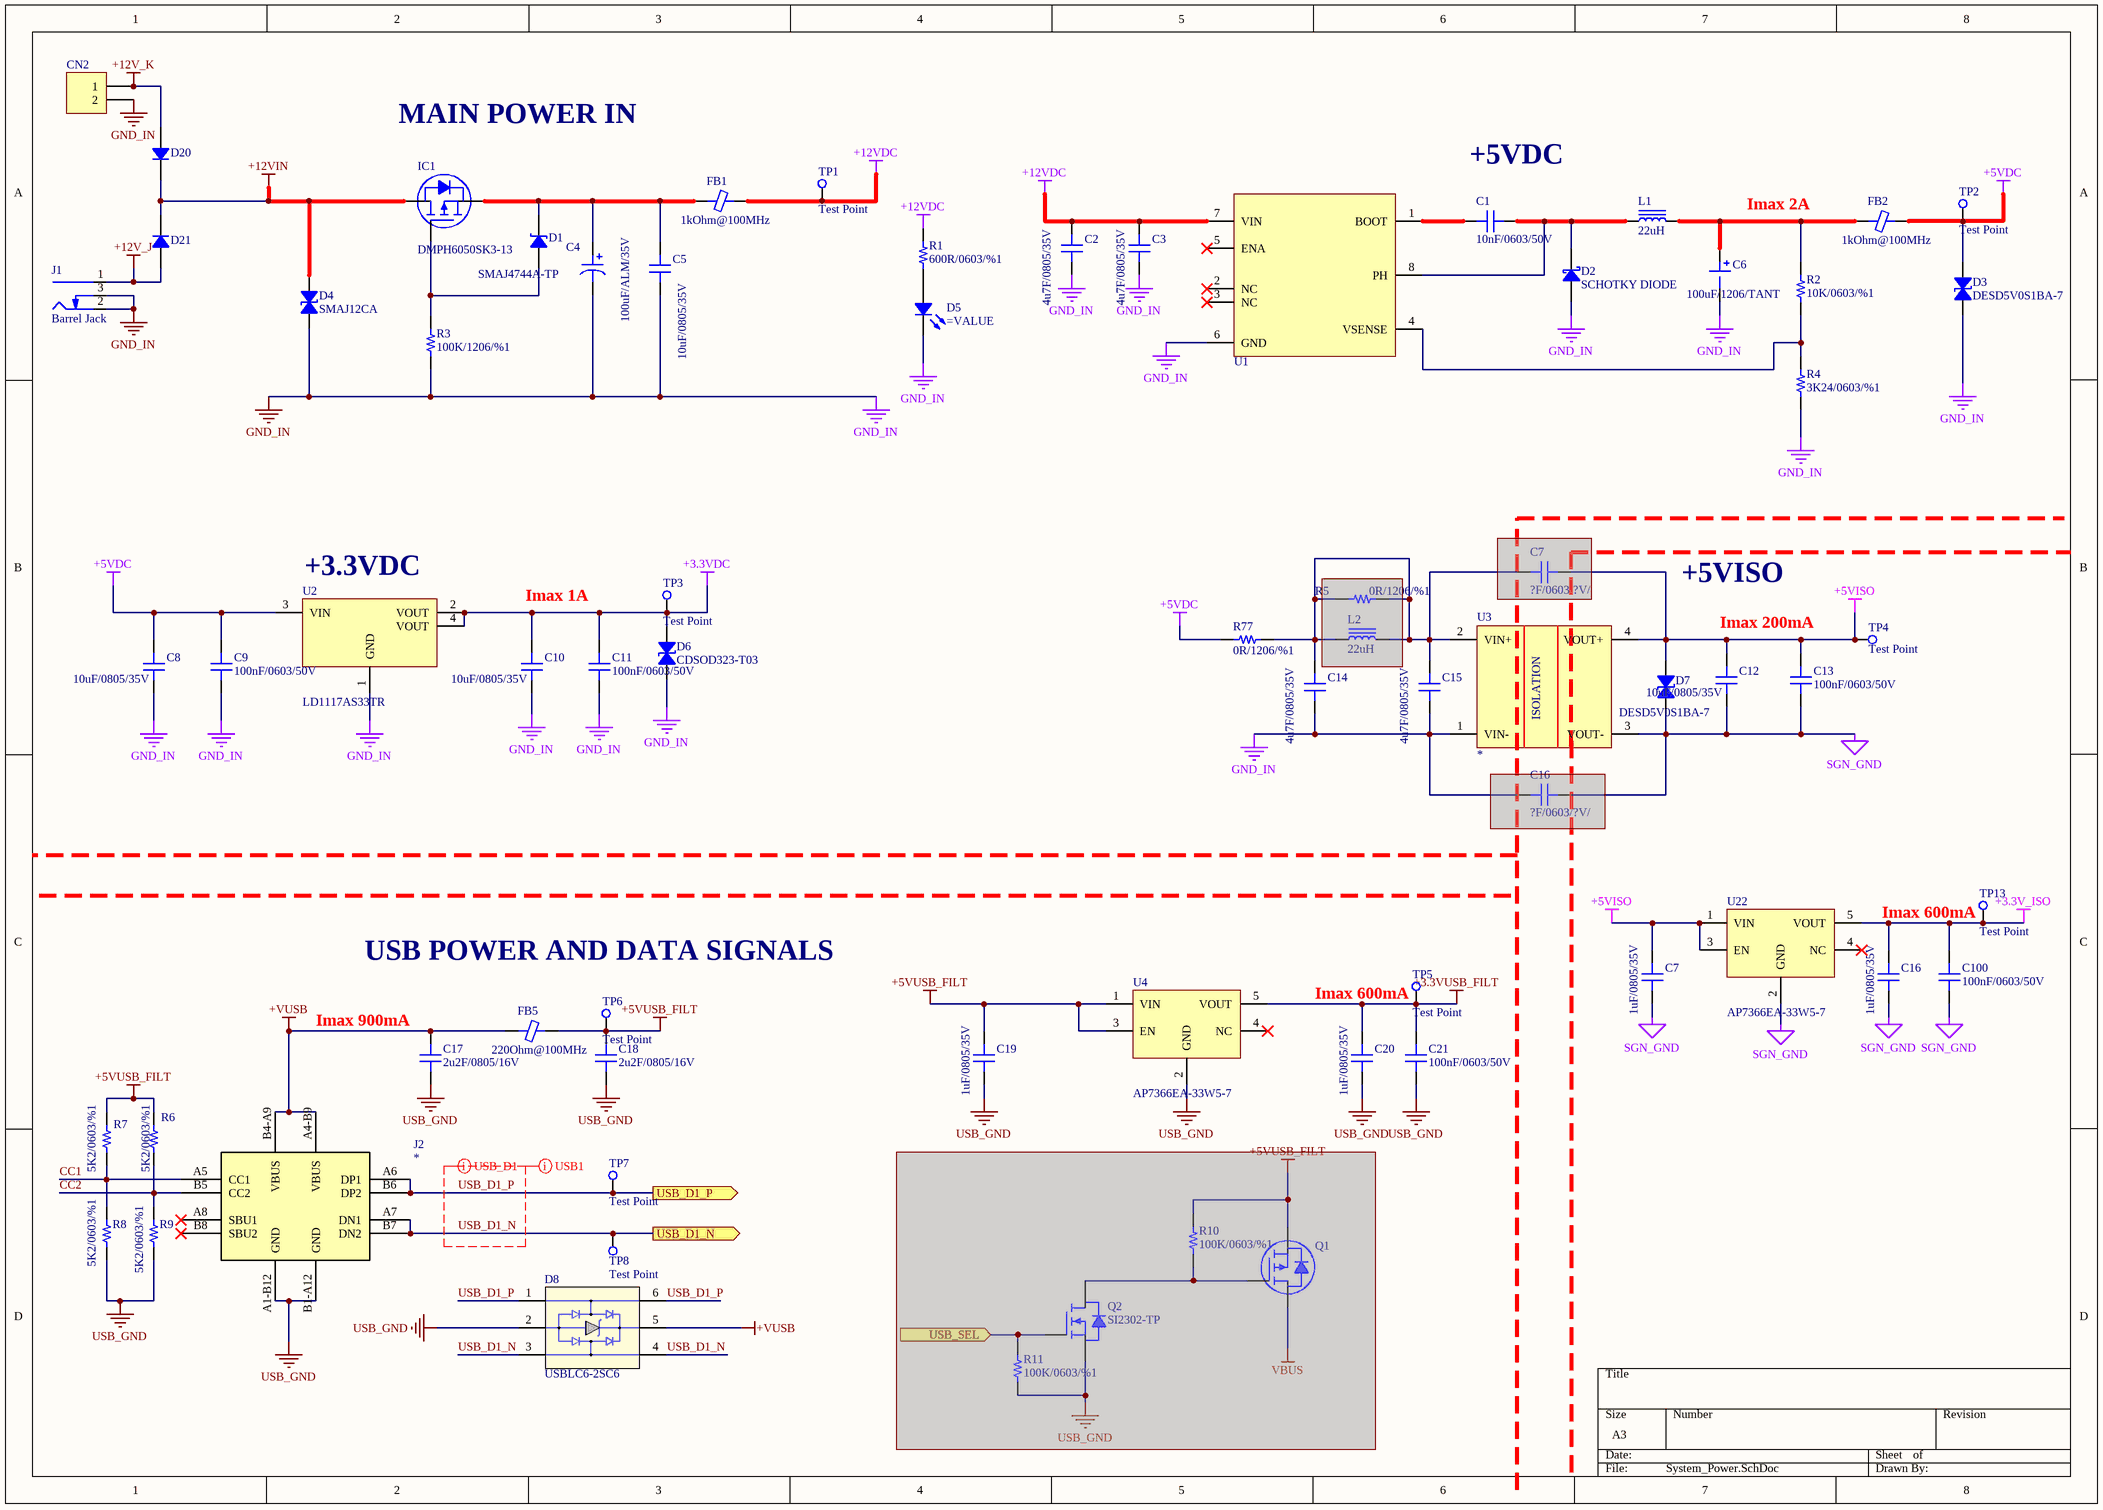
[diagram p5: System_Power.SchDoc]

### Parts
(Parts that share a designator on the sheet are numbered #1, #2 ... from top to bottom, then left to right.)
C1  10nF/0603/50V  [0603_cap]
C2  4u7F/0805/35V  [0805_cap]
C3  4u7F/0805/35V  [0805_cap]
C4  100uF/ALM/35V  [CAP ALSMD 6.6MM]
C5  10uF/0805/35V  [0805_cap]
C6  100uF/1206/TANT  [CAP POL 1206_3216]
C7#1  ?F/0603/?V/  [0402_cap]  (masked out: inside a compile mask, not in the netlist)
C7#2  1uF/0805/35V  [0805_cap]
C8  10uF/0805/35V  [0805_cap]
C9  100nF/0603/50V  [0603_cap]
C10  10uF/0805/35V  [0805_cap]
C11  100nF/0603/50V  [0603_cap]
C12  10uF/0805/35V  [0805_cap]
C13  100nF/0603/50V  [0603_cap]
C14  4u7F/0805/35V  [0805_cap]
C15  4u7F/0805/35V  [0805_cap]
C16#1  ?F/0603/?V/  [0402_cap]  (masked out: inside a compile mask, not in the netlist)
C16#2  1uF/0805/35V  [0805_cap]
C17  2u2F/0805/16V  [0805_cap]
C18  2u2F/0805/16V  [0805_cap]
C19  1uF/0805/35V  [0805_cap]
C20  1uF/0805/35V  [0805_cap]
C21  100nF/0603/50V  [0603_cap]
C100  100nF/0603/50V  [0603_cap]
CN2  DG128-5.0-02P-14-00AH  [klemens]  (value not drawn)
D1  SMAJ4744A-TP  [SOD323]
D2  SCHOTKY DIODE  [DO214AC SMA]
D3  DESD5V0S1BA-7  [SOD323]
D4  SMAJ12CA  [SOD323]
D5  (no value)  [LED 0603_1608 GREEN]
D6  CDSOD323-T03  [SOD323]
D7  DESD5V0S1BA-7  [SOD323]
D8  USBLC6-2SC6  [TI SOT-23-6 DBV]
D20  (no value)  [DO214AC SMA]
D21  (no value)  [DO214AC SMA]
FB1  1kOhm@100MHz  [0805_ferrite]
FB2  1kOhm@100MHz  [0805_ferrite]
FB5  220Ohm@100MHz  [0805_ferrite]
IC1  DMPH6050SK3-13  [TO 252]
J1  Barrel Jack  [CUI_PJ-002B]
J2  *  [USB4105_GCT]
L1  22uH  [IND(8.00mm x 8.00mm)]
L2  22uH  [IND(8.00mm x 8.00mm)]  (masked out: inside a compile mask, not in the netlist)
Q1  (no value)  [TI SOT-23-3 DBZ]  (masked out: inside a compile mask, not in the netlist)
Q2  SI2302-TP  [TI SOT-23-3 DBZ]  (masked out: inside a compile mask, not in the netlist)
R1  600R/0603/%1  [0603_res]
R2  10K/0603/%1  [0603_res]
R3  100K/1206/%1  [1206_res]
R4  3K24/0603/%1  [0603_res]
R5#1  0R/1206/%1  [1206_res]  (masked out: inside a compile mask, not in the netlist)
R6  5K2/0603/%1  [0603_res]
R7  5K2/0603/%1  [0603_res]
R8  5K2/0603/%1  [0603_res]
R9  5K2/0603/%1  [0603_res]
R10  100K/0603/%1  [0603_res]  (masked out: inside a compile mask, not in the netlist)
R11  100K/0603/%1  [0603_res]  (masked out: inside a compile mask, not in the netlist)
R77  0R/1206/%1  [0603_res]
TP1  Test Point  [tp]
TP2  Test Point  [tp]
TP3  Test Point  [tp]
TP4  Test Point  [tp]
TP5  Test Point  [tp]
TP6  Test Point  [tp]
TP7  Test Point  [tp]
TP8  Test Point  [tp]
TP13  Test Point  [tp]
U1  *  [SOIC-8(3.90MM)]  (value not drawn)
U2  LD1117AS33TR  [SOT-223]
U3  *  [SIP4]
U4  AP7366EA-33W5-7  [SOT25]
U22  AP7366EA-33W5-7  [SOT25]

### Ports
USB_D1_N (out, see Main[2A], USB_Isolation[1D]), USB_D1_P (out, see Main[2A], USB_Isolation[1D]), USB_SEL (in, see Main[2A], USB_Isolation[2A])

### Nets
+3.3V_ISO: C16#2.2 C100.2 TP13.1(TP) U22.5(VOUT)
+3.3VDC: C10.2 C11.2 D6.2 TP3.1(TP) U2.2(VOUT) U2.4(VOUT)
+3.3VUSB_FILT: C20.2 C21.2 TP5.1(TP) U4.5(VOUT)
+5VDC: C8.2 C9.2 D3.2 FB2.2 R77.2 TP2.1(TP) U2.3(VIN)
+5VISO: C7#2.2 C12.2 C13.2 D7.2 TP4.1(TP) U3.4(VOUT+) U22.1(VIN) U22.3(EN)
+5VUSB_FILT: C18.2 C19.2 FB5.2 R6.2 R7.2 TP6.1(TP) U4.1(VIN) U4.3(EN)
+12V_J: D21.1 J1.1(Centre)
+12V_K: CN2.1 D20.1
+12VDC: C2.2 C3.2 FB1.2 R1.2 TP1.1(TP) U1.7(VIN)
+12VIN: D4.2 D20.2 D21.2 IC1.D
+VUSB: C17.2 D8.5 FB5.1 J2.A4-B9(VBUS) J2.B4-A9(VBUS)
GND_IN: C2.1 C3.1 C4.1 C5.1 C6.2 C8.1 C9.1 C10.1 C11.1 C14.1 C15.1 CN2.2 D2.2 D3.1 D4.1 D5.2 D6.1 J1.2(Outer) J1.3(SW) R3.1 R4.1 U1.6(GND) U2.1(GND) U3.1(VIN-)
SGN_GND: C7#2.1 C12.1 C13.1 C16#2.1 C100.1 D7.1 U3.3(VOUT-) U22.2(GND)
USB_GND: C17.1 C18.1 C19.1 C20.1 C21.1 D8.2 J2.A1-B12(GND) J2.B1-A12(GND) R8.1 R9.1 U4.2(GND)
CC1: J2.A5(CC1) R7.1 R8.2
CC2: J2.B5(CC2) R6.1 R9.2
USB_D1_N: D8.3 D8.4 J2.A7(DN1) J2.B7(DN2) TP8.1(TP) ; port USB_D1_N
USB_D1_P: D8.1 D8.6 J2.A6(DP1) J2.B6(DP2) TP7.1(TP) ; port USB_D1_P
NetC1_1: C1.1 D2.1 L1.1 U1.8(PH)
NetC1_2: C1.2 U1.1(BOOT)
NetC4_2: C4.2 C5.2 D1.2 FB1.1 IC1.S
NetC6_1: C6.1 FB2.1 L1.2 R2.2
NetC14_2: C14.2 C15.2 R77.1 U3.2(VIN+)
NetD1_1: D1.1 IC1.G R3.2
NetD5_1: D5.1 R1.1
NetR2_1: R2.1 R4.2 U1.4(VSENSE)

Not connected (* = marked no-connect by the designer): J2 A8(SBU1)* B8(SBU2)*; U1 2(NC)* 3(NC)* 5(ENA)*; U4 4(NC)*; U22 4(NC)*

### Layout directives
mark named USB1: USB_D1_N, USB_D1_P
differential pair: USB_D1_N, USB_D1_P

### Notes on the sheet
- MAIN POWER IN
- (near C1) +5VDC
- Imax 2A
- (near U2) +3.3VDC
- +5VISO
- Imax 1A
- Imax 200mA
- (near TP13) Imax 600mA
- USB POWER AND DATA SIGNALS
- (near C17) Imax 900mA
- (near TP5) Imax 600mA
- (in symbol RFM-0505S) ISOLATION

### Library data of the parts
C1-C3 C5 C7#1 C7#2 C8-C15 C16#1 C16#2 C17-C21 C100 = Capacitor: HelpURL: *; PN: *; Assembly: *
  C1: Value: 10nF/0603/50V
  C2 C3 C14 C15: Value: 4u7F/0805/35V
  C5 C8 C10 C12: Value: 10uF/0805/35V
  C7#1 C16#1: Value: ?F/0603/?V/
  C7#2 C16#2 C19 C20: Value: 1uF/0805/35V
  C9 C11 C13 C21 C100: Value: 100nF/0603/50V
  C17 C18: Value: 2u2F/0805/16V
C4 = Polarised Capacitor IPC: SMT Polarised Capacitor
C6 = tantalcap: MFC PN: TLJA107M010R1400; Assembly: *; Help URL: *; Manufacturer: *; Value: 100uF/1206/TANT
CN2 = klemens_2p: Value: DG128-5.0-02P-14-00AH; Parameter 2: DG128-5.0-02P-14-00AH; Parameter 3: DG128-5.0-02P-14-00AH
D1 = Diode Zener: Zener Diode; Assembly: .; Value: SMAJ4744A-TP; HelpURL: https://www.digikey.com/en/products/detail/mcc-micro-commercial-components/SMAJ4744A-TP/950471?s=N4IgTCBcDaIMoFkCCApALAdjWpBaAKgAogC6AvkA; PN: SMAJ4744A-TP
D2 = SCHOTKY DIODE: Value: B340AE-13; Assembly: .; PN: B340AE-13; HelpURL: https://www.digikey.com/en/products/detail/diodes-incorporated/B340AE-13/7352831
D3 D4 D6 D7 = TVS BI: Zener Diode; Assembly: .
  D3 D7: HelpURL: https://www.digikey.com/en/products/detail/diodes-incorporated/DESD5V0S1BA-7/3451477?s=N4IgTCBcDaICIFEDKcCsA1ADEgjAIQEEBaAdhAF0BfIA; PN: DESD5V0S1BA-7; Value: DESD5V0S1BA-7
  D4: HelpURL: https://www.digikey.com/en/products/detail/bourns-inc/SMAJ12CA/2254385; PN: SMAJ12CA; Value: SMAJ12CA
  D6: HelpURL: https://www.digikey.com/en/products/detail/bourns-inc/CDSOD323-T03/3742076; PN: CDSOD323-T03; Value: CDSOD323-T03
D5 = LED: Chip LED
D8 = USBLC6-2SC6: 17V Clamp 5A (8/20µs) Ipp Tvs Diode Surface Mount SOT-23-6; Assembly: .; Value: USBLC6-2SC6; PN: USBLC6-2SC6; HelpURL: https://www.digikey.com/en/products/detail/stmicroelectronics/USBLC6-2SC6/1040559
D20 D21 = Diode: Rectifier Diode
FB1 FB2 FB5 = Ferrite Chip: SMT Ferrite Chip
IC1 = P-CHN MOS: Assembly: .; Value: DMPH6050SK3-13; HelpURL: https://www.digikey.com/en/products/detail/diodes-incorporated/DMPH6050SK3-13/6010147; PN: DMPH6050SK3-13
J1 = Barrel Connector: Value: PJ-002B; Assembly: .; PN: PJ-002B; HelpURL: https://www.digikey.com/en/products/detail/same-sky-formerly-cui-devices/PJ-002B/96965
J2 = USB2.0 TYP C: No Description Available; Value: *; HelpURL: *; PN: *; Assembly: *
L1 L2 = Inductor: SMT Inductor; PN: SRN8040TA-220M; Assembly: .; Value: 22uH; HelpURL: https://www.digikey.com/en/products/detail/bourns-inc/SRN8040TA-220M/6155131
Q1 = P-CHN MOS SOT: MOSFET P-CH 20V 4.2A SOT23; Value: DMG2305UX-7; Assembly: .; PN: DMG2305UX-7; Help URL: https://www.digikey.com/en/products/detail/diodes-incorporated/DMG2305UX-7/4340667
Q2 = N-CHN MOS SOT: MOSFET N-CH 20V 3A SOT-23; Assembly: .; Help URL: https://www.digikey.com/en/products/detail/mcc-micro-commercial-components/SI2302-TP/1793243; PN: SI2302-TP; Value: SI2302-TP
R1-R4 R5#1 R6-R11 R77 = RES: Assembly: .; HelpURL: *; PN: *
  R1: Value: 600R/0603/%1
  R2: Value: 10K/0603/%1
  R3: Value: 100K/1206/%1
  R4: Value: 3K24/0603/%1
  R5#1 R77: Value: 0R/1206/%1
  R6-R9: Value: 5K2/0603/%1
  R10 R11: Value: 100K/0603/%1
U1 = TPS5420xx: Assembly: *; HelpURL: *; PN: *; Value: *
U2 = LD1117: Wide Temperature Three-Pin Adjustable Regulator; Assembly: .; Value: LD1117AS33TR; PN: LD1117AS33TR; HelpURL: https://www.digikey.com/en/products/detail/stmicroelectronics/LD1117AS33TR/585752
U3 = RFM-0505S: Value: *; HelpURL: *; PN: *; Assembly: *
U4 U22 = AP7366EA-33W5-7: IC REG LINEAR 3.3V 600MA SOT-25; Assembly: .; PN: AP7366EA-33W5-7; HelpURL: https://www.digikey.com/en/products/detail/diodes-incorporated/AP7366EA-33W5-7/18635685?s=N4IgTCBcDaIIIAUDsBmAbGgonAtClA6gKw5IgC6AvkA; Value: AP7366EA-33W5-7

## Sheet USB_Isolation.SchDoc
size A4; SheetNumber: 7; SheetTotal: 8
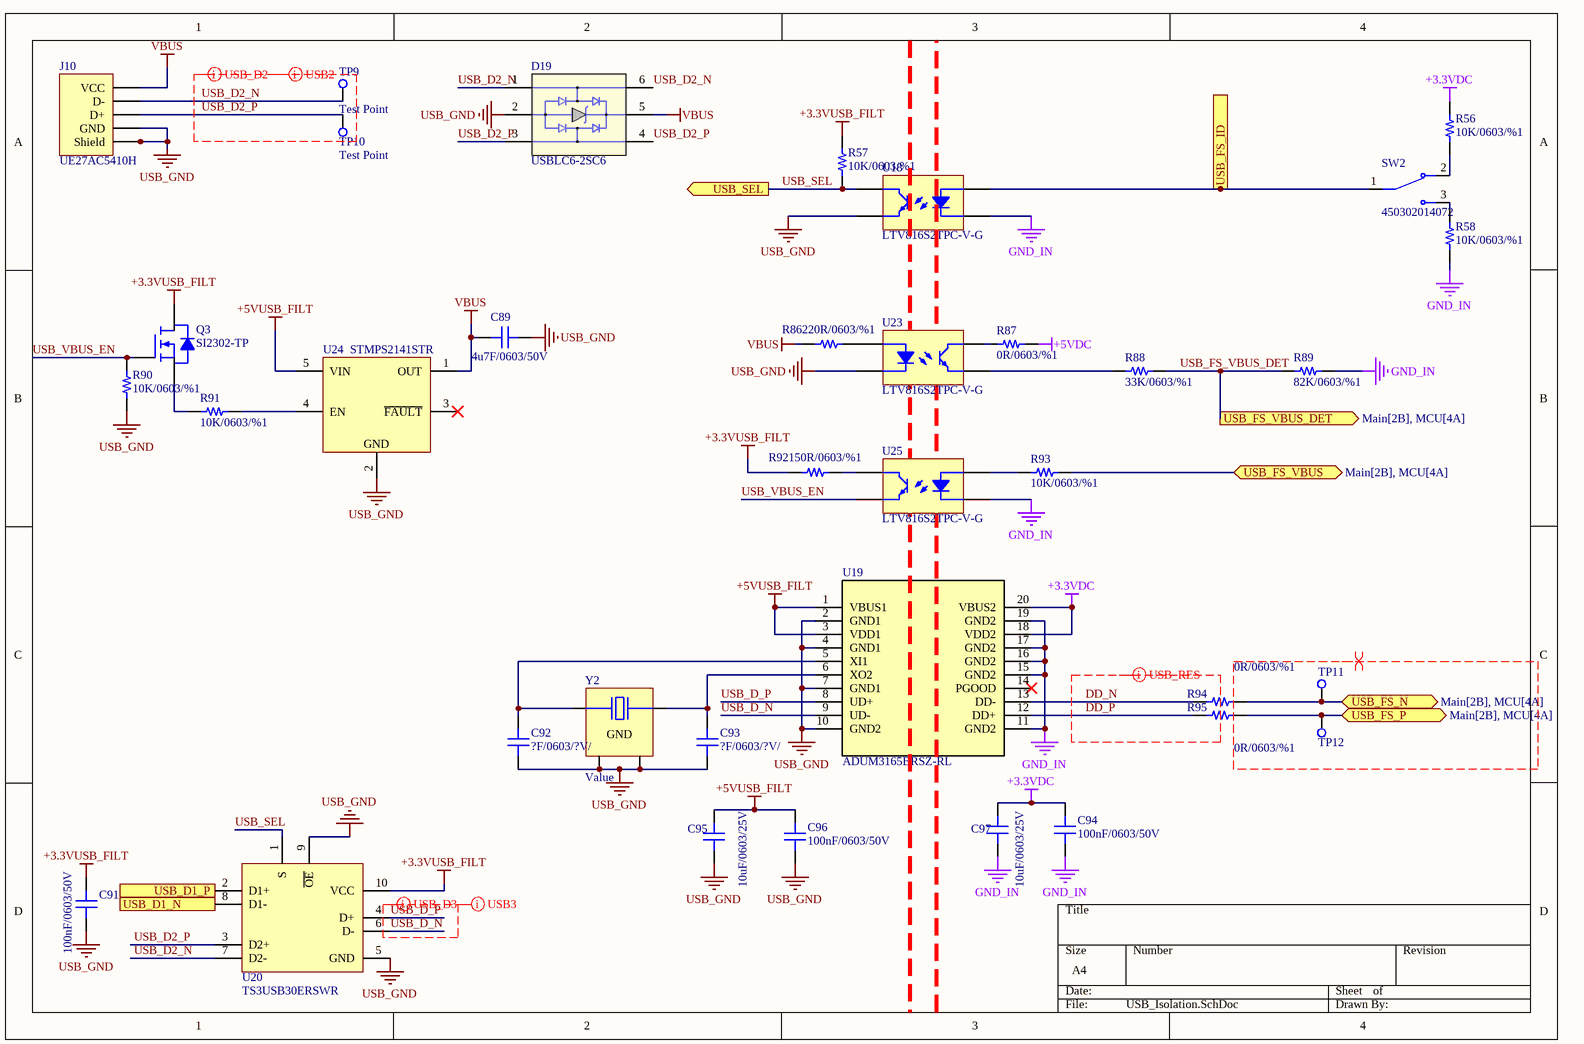
[diagram p6: USB_Isolation.SchDoc]

### Parts
C89  4u7F/0603/50V  [0603_cap]
C91  100nF/0603/50V  [0603_cap]
C92  ?F/0603/?V/  [0603_cap]
C93  ?F/0603/?V/  [0603_cap]
C94  100nF/0603/50V  [0603_cap]
C95  10uF/0603/25V  [0603_cap]
C96  100nF/0603/50V  [0603_cap]
C97  10uF/0603/25V  [0603_cap]
D19  USBLC6-2SC6  [TI SOT-23-6 DBV]
J10  UE27AC5410H  [UE27AC5410H]
Q3  SI2302-TP  [TI SOT-23-3 DBZ]
R56  10K/0603/%1  [0603_res]
R57  10K/0603/%1  [0603_res]
R58  10K/0603/%1  [0603_res]
R86  220R/0603/%1  [0603_res]
R87  0R/0603/%1  [0603_res]
R88  33K/0603/%1  [0603_res]
R89  82K/0603/%1  [0603_res]
R90  10K/0603/%1  [0603_res]
R91  10K/0603/%1  [0603_res]
R92  150R/0603/%1  [0603_res]
R93  10K/0603/%1  [0603_res]
R94  0R/0603/%1  [0603_res]
R95  0R/0603/%1  [0603_res]
SW2  450302014072  [450302014072]
TP9  Test Point  [tp]
TP10  Test Point  [tp]
TP11  Test Point  [tp]  (value not drawn)
TP12  Test Point  [tp]  (value not drawn)
U18  LTV816S2TPC-V-G  [4-SMD, Gull Wing]
U19  ADUM3165BRSZ-RL  [SSOP-20]
U20  TS3USB30ERSWR  [VSSOP-10]
U23  LTV816S2TPC-V-G  [4-SMD, Gull Wing]
U24  STMPS2141STR  [SOT-23-5]
U25  LTV816S2TPC-V-G  [4-SMD, Gull Wing]
Y2  Value  [SMD4-Nolead]

### Ports
USB_D1_N (in, see Main[2B], System_Power[3D]), USB_D1_P (in, see Main[2B], System_Power[3D]), USB_FS_ID (out, see Main[2B], MCU[4A]), USB_FS_N (bidir, see Main[2B], MCU[4A]), USB_FS_P (bidir, see Main[2B], MCU[4A]), USB_FS_VBUS (bidir, see Main[2B], MCU[4A]), USB_FS_VBUS_DET (out, see Main[2B], MCU[4A]), USB_SEL (out, see Main[2B])

### Nets
+3.3VDC: C94.2 C97.2 R56.1 U19.18(VDD2) U19.20(VBUS2)
+3.3VUSB_FILT: C91.1 Q3.3(D) R57.1 R92.1 U20.10(VCC)
+5VDC: R87.1
+5VUSB_FILT: C95.2 C96.2 U19.1(VBUS1) U19.3(VDD1) U24.5(VIN)
GND_IN: C94.1 C97.1 R58.2 R89.2 U18.2 U19.11(GND2) U19.15(GND2) U19.16(GND2) U19.17(GND2) U19.19(GND2) U25.2
USB_GND: C89.2 C91.2 C92.1 C93.1 C95.1 C96.1 D19.2 J10.04(GND) J10.S1(Shield) J10.S2(Shield) R90.1 U18.3 U19.2(GND1) U19.4(GND1) U19.7(GND1) U19.10(GND2) U20.5(GND) U20.9(~{OE}) U23.2 U24.2(GND) Y2.2(GND) Y2.4(GND)
VBUS: C89.1 D19.5 J10.01(VCC) R86.1 U24.1(OUT)
DD_N: R94.2 U19.13(DD-)
DD_P: R95.2 U19.12(DD+)
USB_D1_N: U20.8(D1-) ; port USB_D1_N
USB_D1_P: U20.2(D1+) ; port USB_D1_P
USB_D2_N: D19.1 D19.6 J10.02(D-) TP9.1(TP) U20.7(D2-)
USB_D2_P: D19.3 D19.4 J10.03(D+) TP10.1(TP) U20.3(D2+)
USB_D_N: U19.9(UD-) U20.6(D-)
USB_D_P: U19.8(UD+) U20.4(D+)
USB_FS_ID: SW2.1 U18.1 ; port USB_FS_ID
USB_FS_N: R94.1 TP11.1(TP) ; port USB_FS_N
USB_FS_P: R95.1 TP12.1(TP) ; port USB_FS_P
USB_FS_VBUS: R93.1 ; port USB_FS_VBUS
USB_FS_VBUS_DET: R88.2 R89.1 ; port USB_FS_VBUS_DET
USB_SEL: R57.2 U18.4 U20.1(S) ; port USB_SEL
USB_VBUS_EN: Q3.1(G) R90.2 U25.3
NetC92_2: C92.2 U19.5(XI1) Y2.1
NetC93_2: C93.2 U19.6(XO2) Y2.3
NetQ3_2: Q3.2(S) R91.1
NetR56_2: R56.2 SW2.2
NetR58_1: R58.1 SW2.3
NetR86_2: R86.2 U23.1
NetR87_2: R87.2 U23.4
NetR88_1: R88.1 U23.3
NetR91_2: R91.2 U24.4(EN)
NetR92_2: R92.2 U25.4
NetR93_2: R93.2 U25.1

Not connected (* = marked no-connect by the designer): U19 14(PGOOD)*; U24 3(~{FAULT})*

### Layout directives
differential pair: (no net found under the mark), DD_N, DD_P, USB_D2_N, USB_D2_P, USB_D_N, USB_D_P
mark named USB2: USB_D2_N, USB_D2_P
mark named USB3: USB_D_N, USB_D_P

### Library data of the parts
C89 C91-C97 = Capacitor: HelpURL: *; PN: *; Assembly: *
  C89: Value: 4u7F/0603/50V
  C91 C94 C96: Value: 100nF/0603/50V
  C92 C93: Value: ?F/0603/?V/
  C95 C97: Value: 10uF/0603/25V
D19 = USBLC6-2SC6: as D8 on sheet System_Power; Value: USBLC6-2SC6; PN: USBLC6-2SC6; HelpURL: https://www.digikey.com/en/products/detail/stmicroelectronics/USBLC6-2SC6/1040559
J10 = USB 2.0 TYPE A: Assembly: .; Value: UE27AC5410H; PN: UE27AC5410H; HelpURL: https://www.ozdisan.com/p/usb-konnektorler-357/amphenol-ue27ac5410h-625506
Q3 = N-CHN MOS SOT: MOSFET N-CH 20V 3A SOT-23; Assembly: .; Help URL: https://www.digikey.com/en/products/detail/mcc-micro-commercial-components/SI2302-TP/1793243; PN: SI2302-TP; Value: SI2302-TP
R56-R58 R86-R95 = RES: Assembly: .; HelpURL: *; PN: *
  R56-R58 R90 R91 R93: Value: 10K/0603/%1
  R86: Value: 220R/0603/%1
  R87 R94 R95: Value: 0R/0603/%1
  R88: Value: 33K/0603/%1
  R89: Value: 82K/0603/%1
  R92: Value: 150R/0603/%1
SW2 = SPDT: Assembly: .; Value: 450302014072; PN: 450302014072; HelpURl: https://www.digikey.com/en/products/detail/w%C3%BCrth-elektronik/450302014072/5209105
U18 U23 U25 = OPTO: Assembly: .; Value: LTV816S2TPC-V-G; PN: LTV816S2TPC-V-G; HelpURL: https://www.ozdisan.com/p/transistor-ve-fotovoltaik-cikisli-optokuplorler-189/liteon-ltv816s2tpc-v-g-951812
U19 = ADUM3165: 3.75 kV RMS Digital Isolators for Isolated USB 2.0 High, Full, and Low Speed; Assembly: .; Value: ADUM3165BRSZ-RL; PN: ADUM3165BRSZ-RL; HelpURL: https://www.digikey.com/en/products/detail/analog-devices-inc/ADUM3165BRSZ-RL/16580710
U20 = TS3USB30ERSWR: Assembly: .; PN: TS3USB30ERSWR; Value: TS3USB30ERSWR; helpURL: https://www.digikey.com/en/products/detail/texas-instruments/TS3USB30ERSWR/2092506
U24 = STMPS2141STR: IC PWR SWITCH N-CHAN 1:1 SOT23-5; Manufacturer: STMicroelectronics; Assembly: .; Help URL: https://www.ozdisan.com/p/power-switch-entegreleri-283/stm-stmps2141str-481741; PN: STMPS2141STR; Value: STMPS2141STR
Y2 = Crystal(4-SMD): 25 MHz ±10ppm Crystal 10pF 50 Ohms 4-SMD, No Lead; Value: ABM8-25.000MHZ-10-D1G-T; Assembly: .; PN: ABM8-25.000MHZ-10-D1G-T; HelpURL: https://www.digikey.com/en/products/detail/abracon-llc/ABM8-25-000MHZ-10-D1G-T/5980064?s=N4IgTCBcDaIIICECyAOAtGArAOgAz6QAkAtNARlzQBEyBxNAFRAF0BfIA